# EasyEDA Pro project STM32平衡小车V1.1.eprj

# Schematic 平衡小车

## Sheets
1 STM32F103C8T6: Create Date: 2023-11-09; Page Name: STM32F103C8T6; Project Name: STM32平衡小车V1.1; Schematic Name: 平衡小车; Update Date: 2023-12-26; Company: 嘉立创EDA; Page Size: A4; Version: V1.0
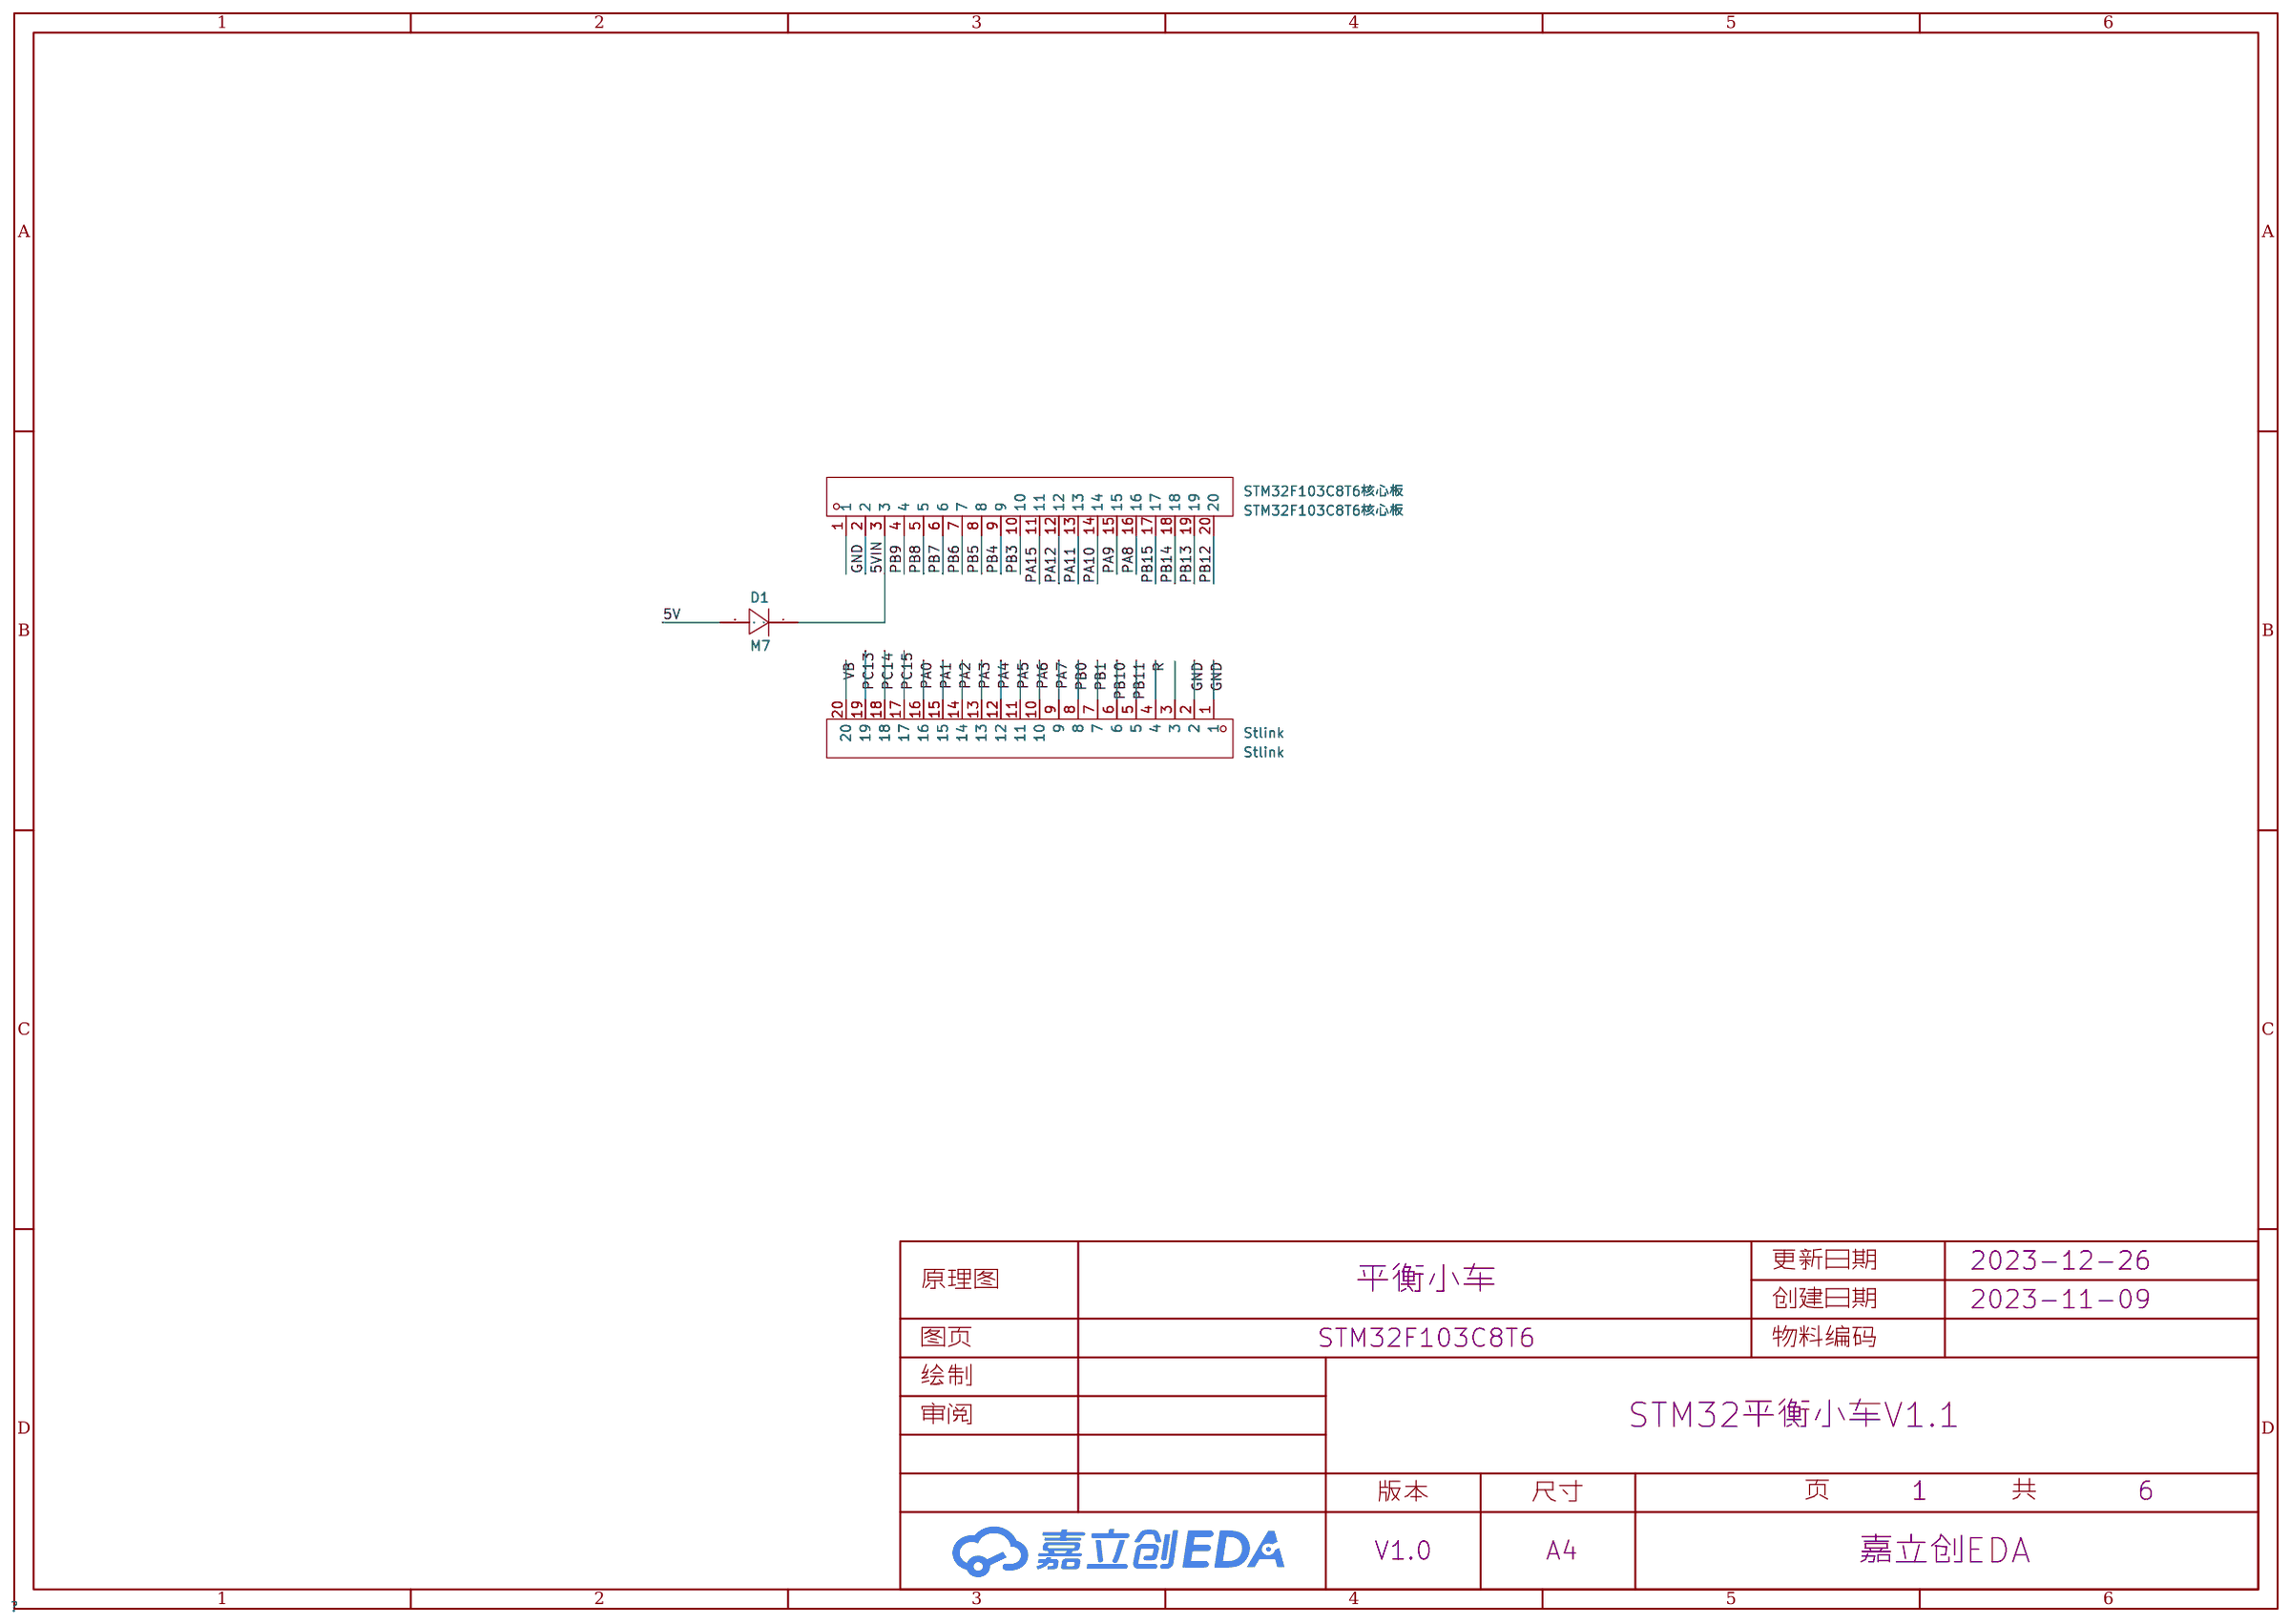
[diagram p0: STM32F103C8T6]
2 串口: Page Name: 串口; Project Name: STM32平衡小车V2.0; Update Date: 2023-12-01
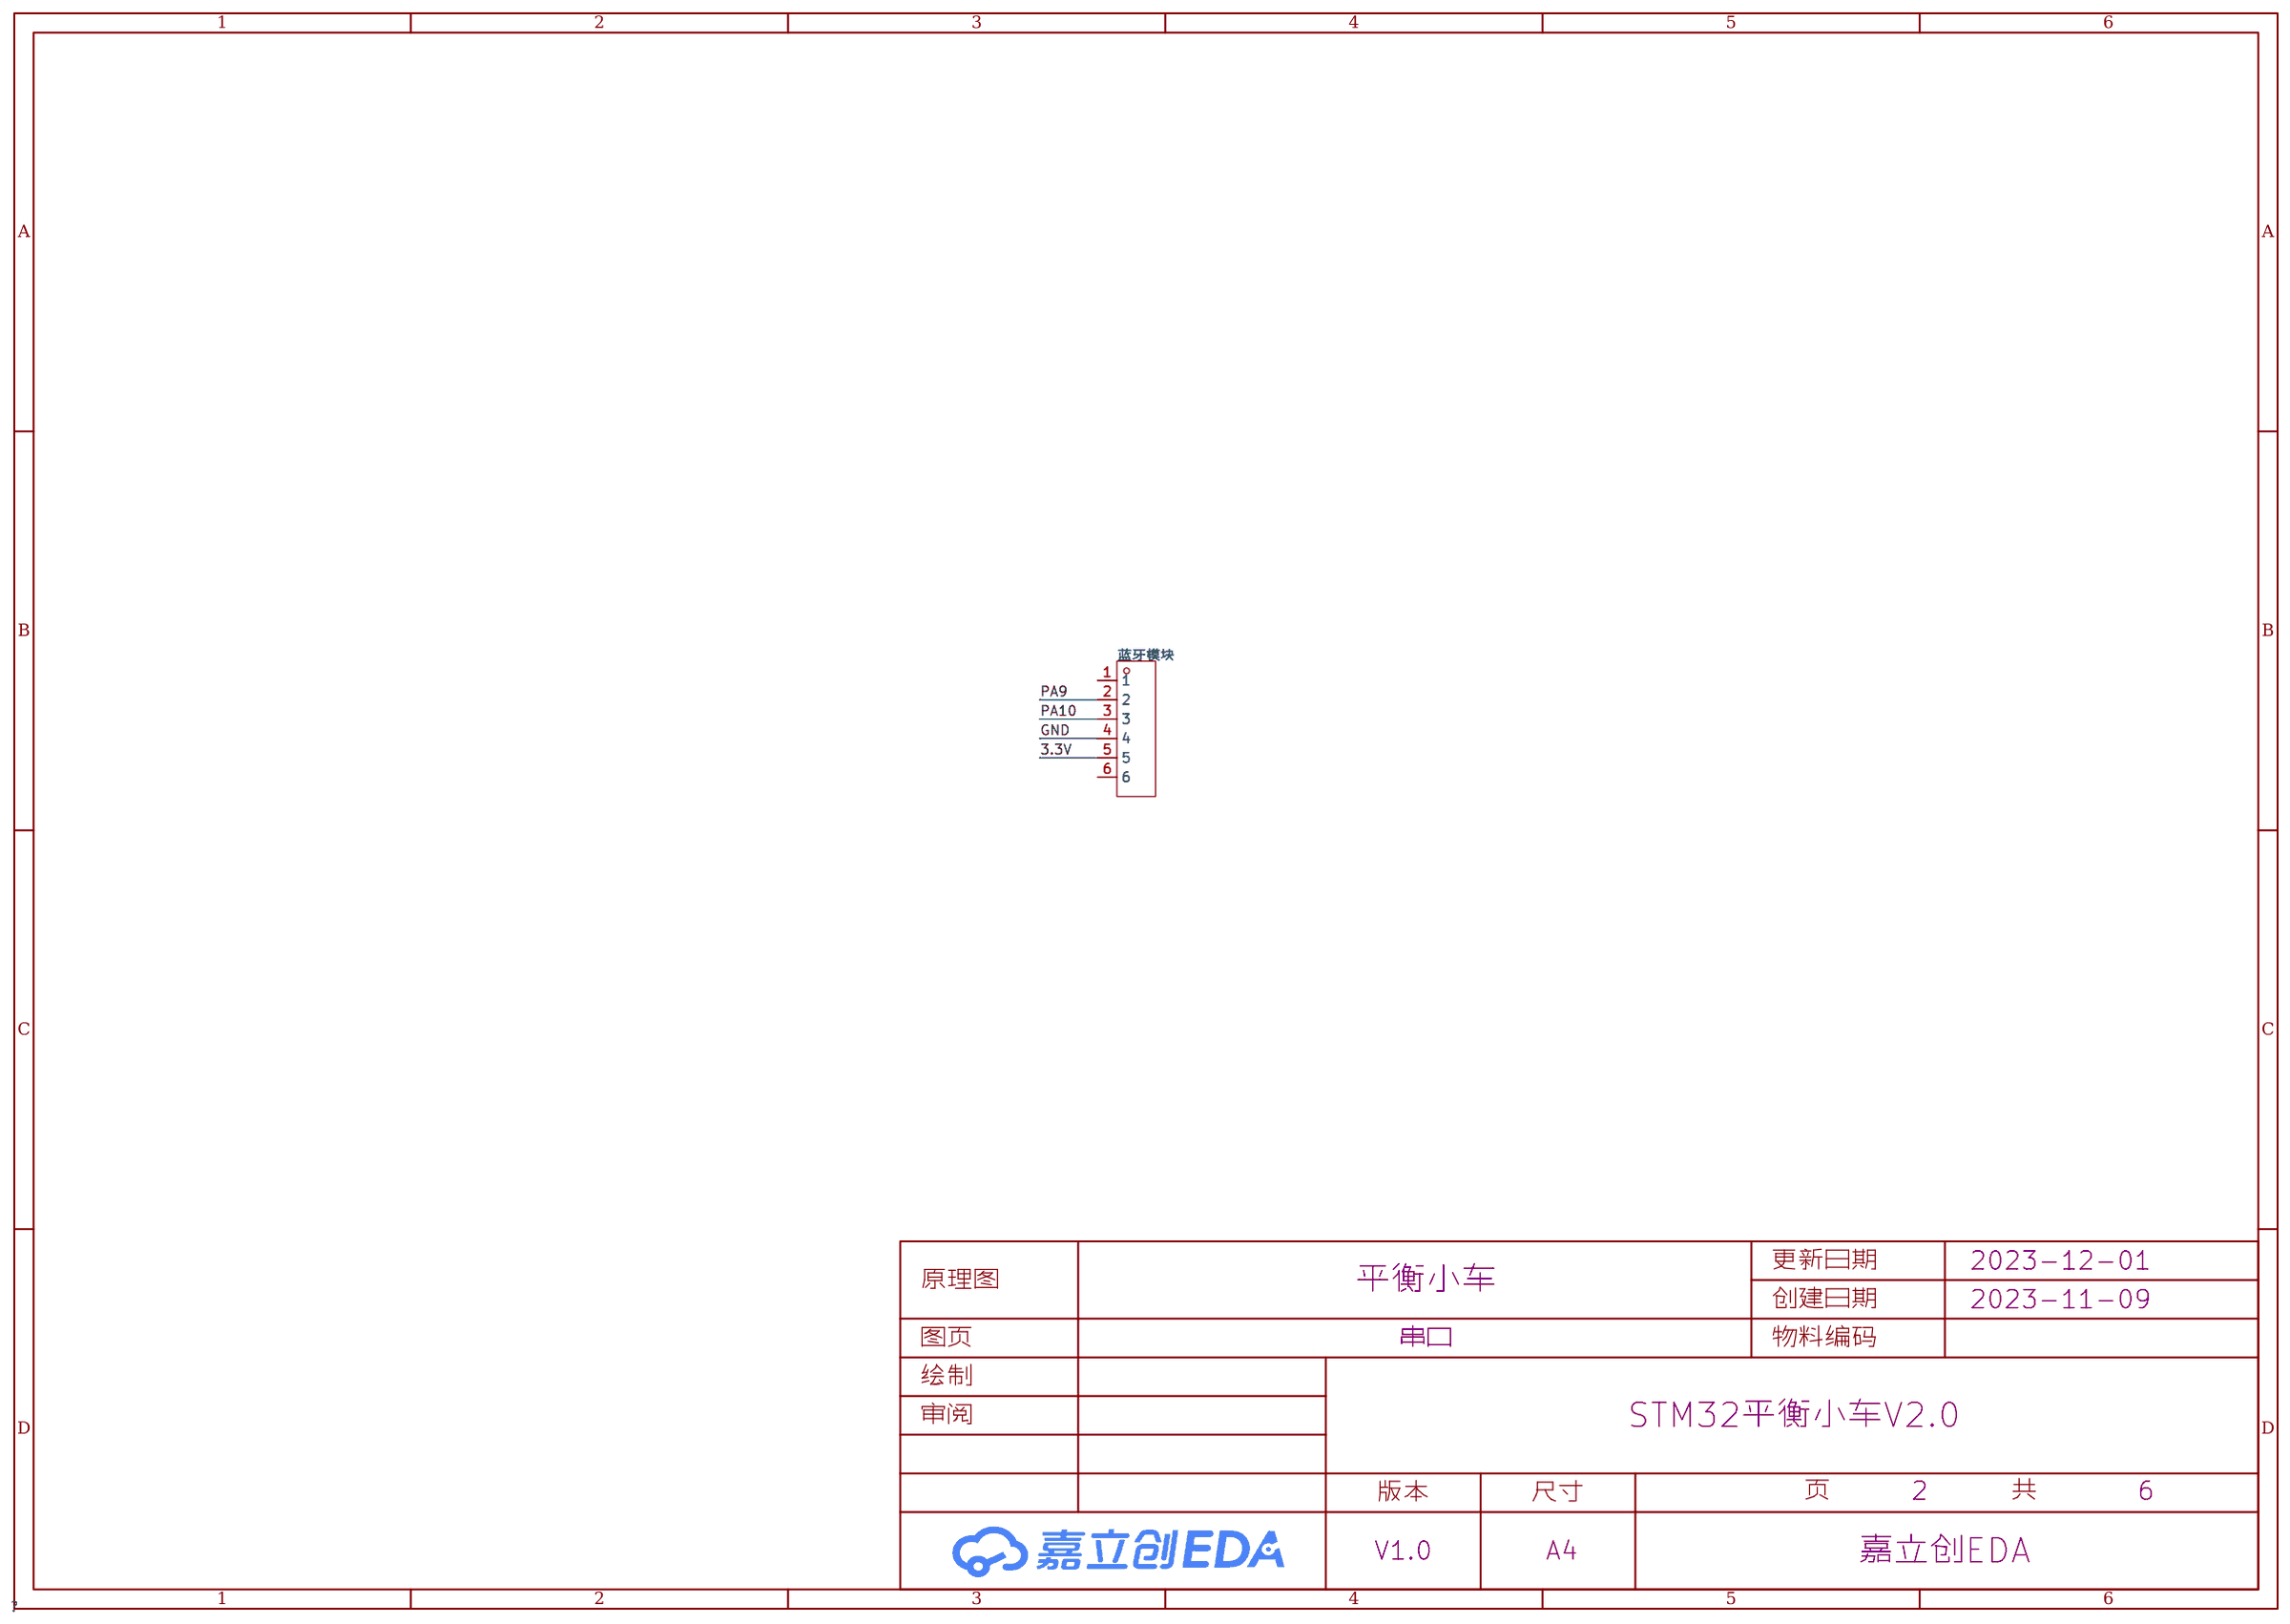
[diagram p1: 串口]
3 陀螺仪: Page Name: 陀螺仪; Project Name: STM32平衡小车V2.0; Update Date: 2023-12-01
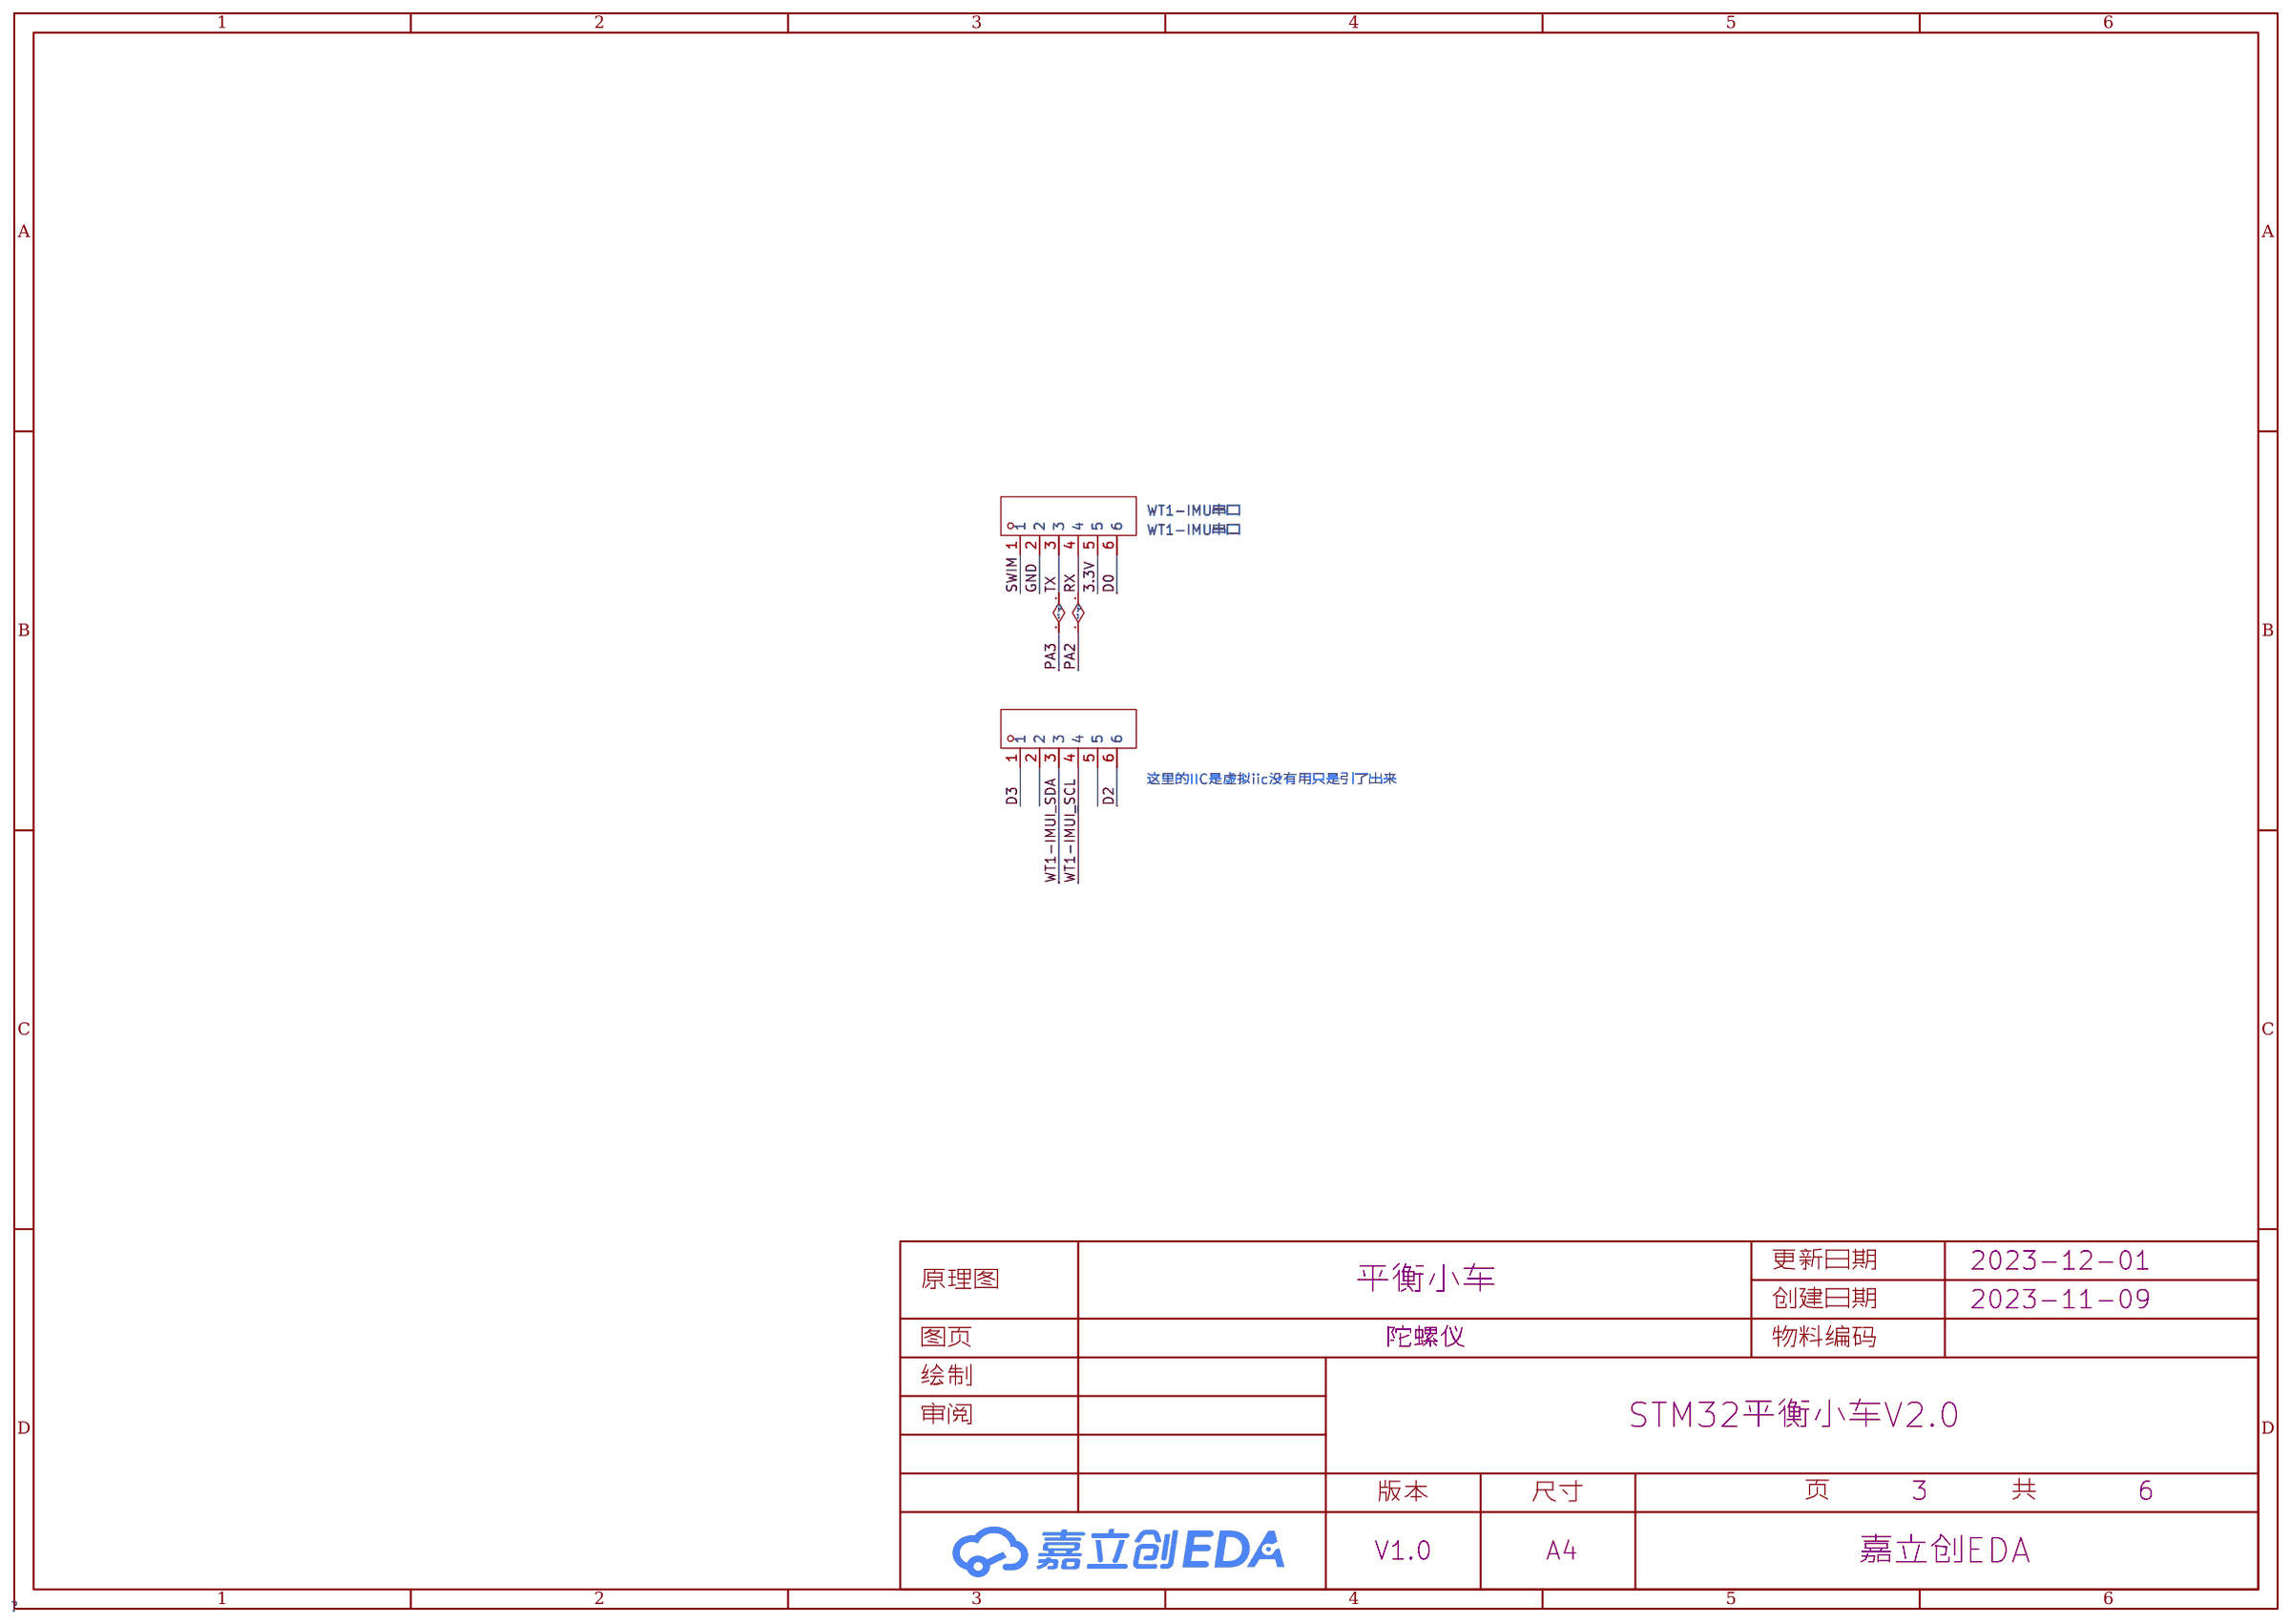
[diagram p2: 陀螺仪]
4 电源与降压模块: Page Name: 电源与降压模块; Project Name: STM32平衡小车V2.0; Update Date: 2023-12-01
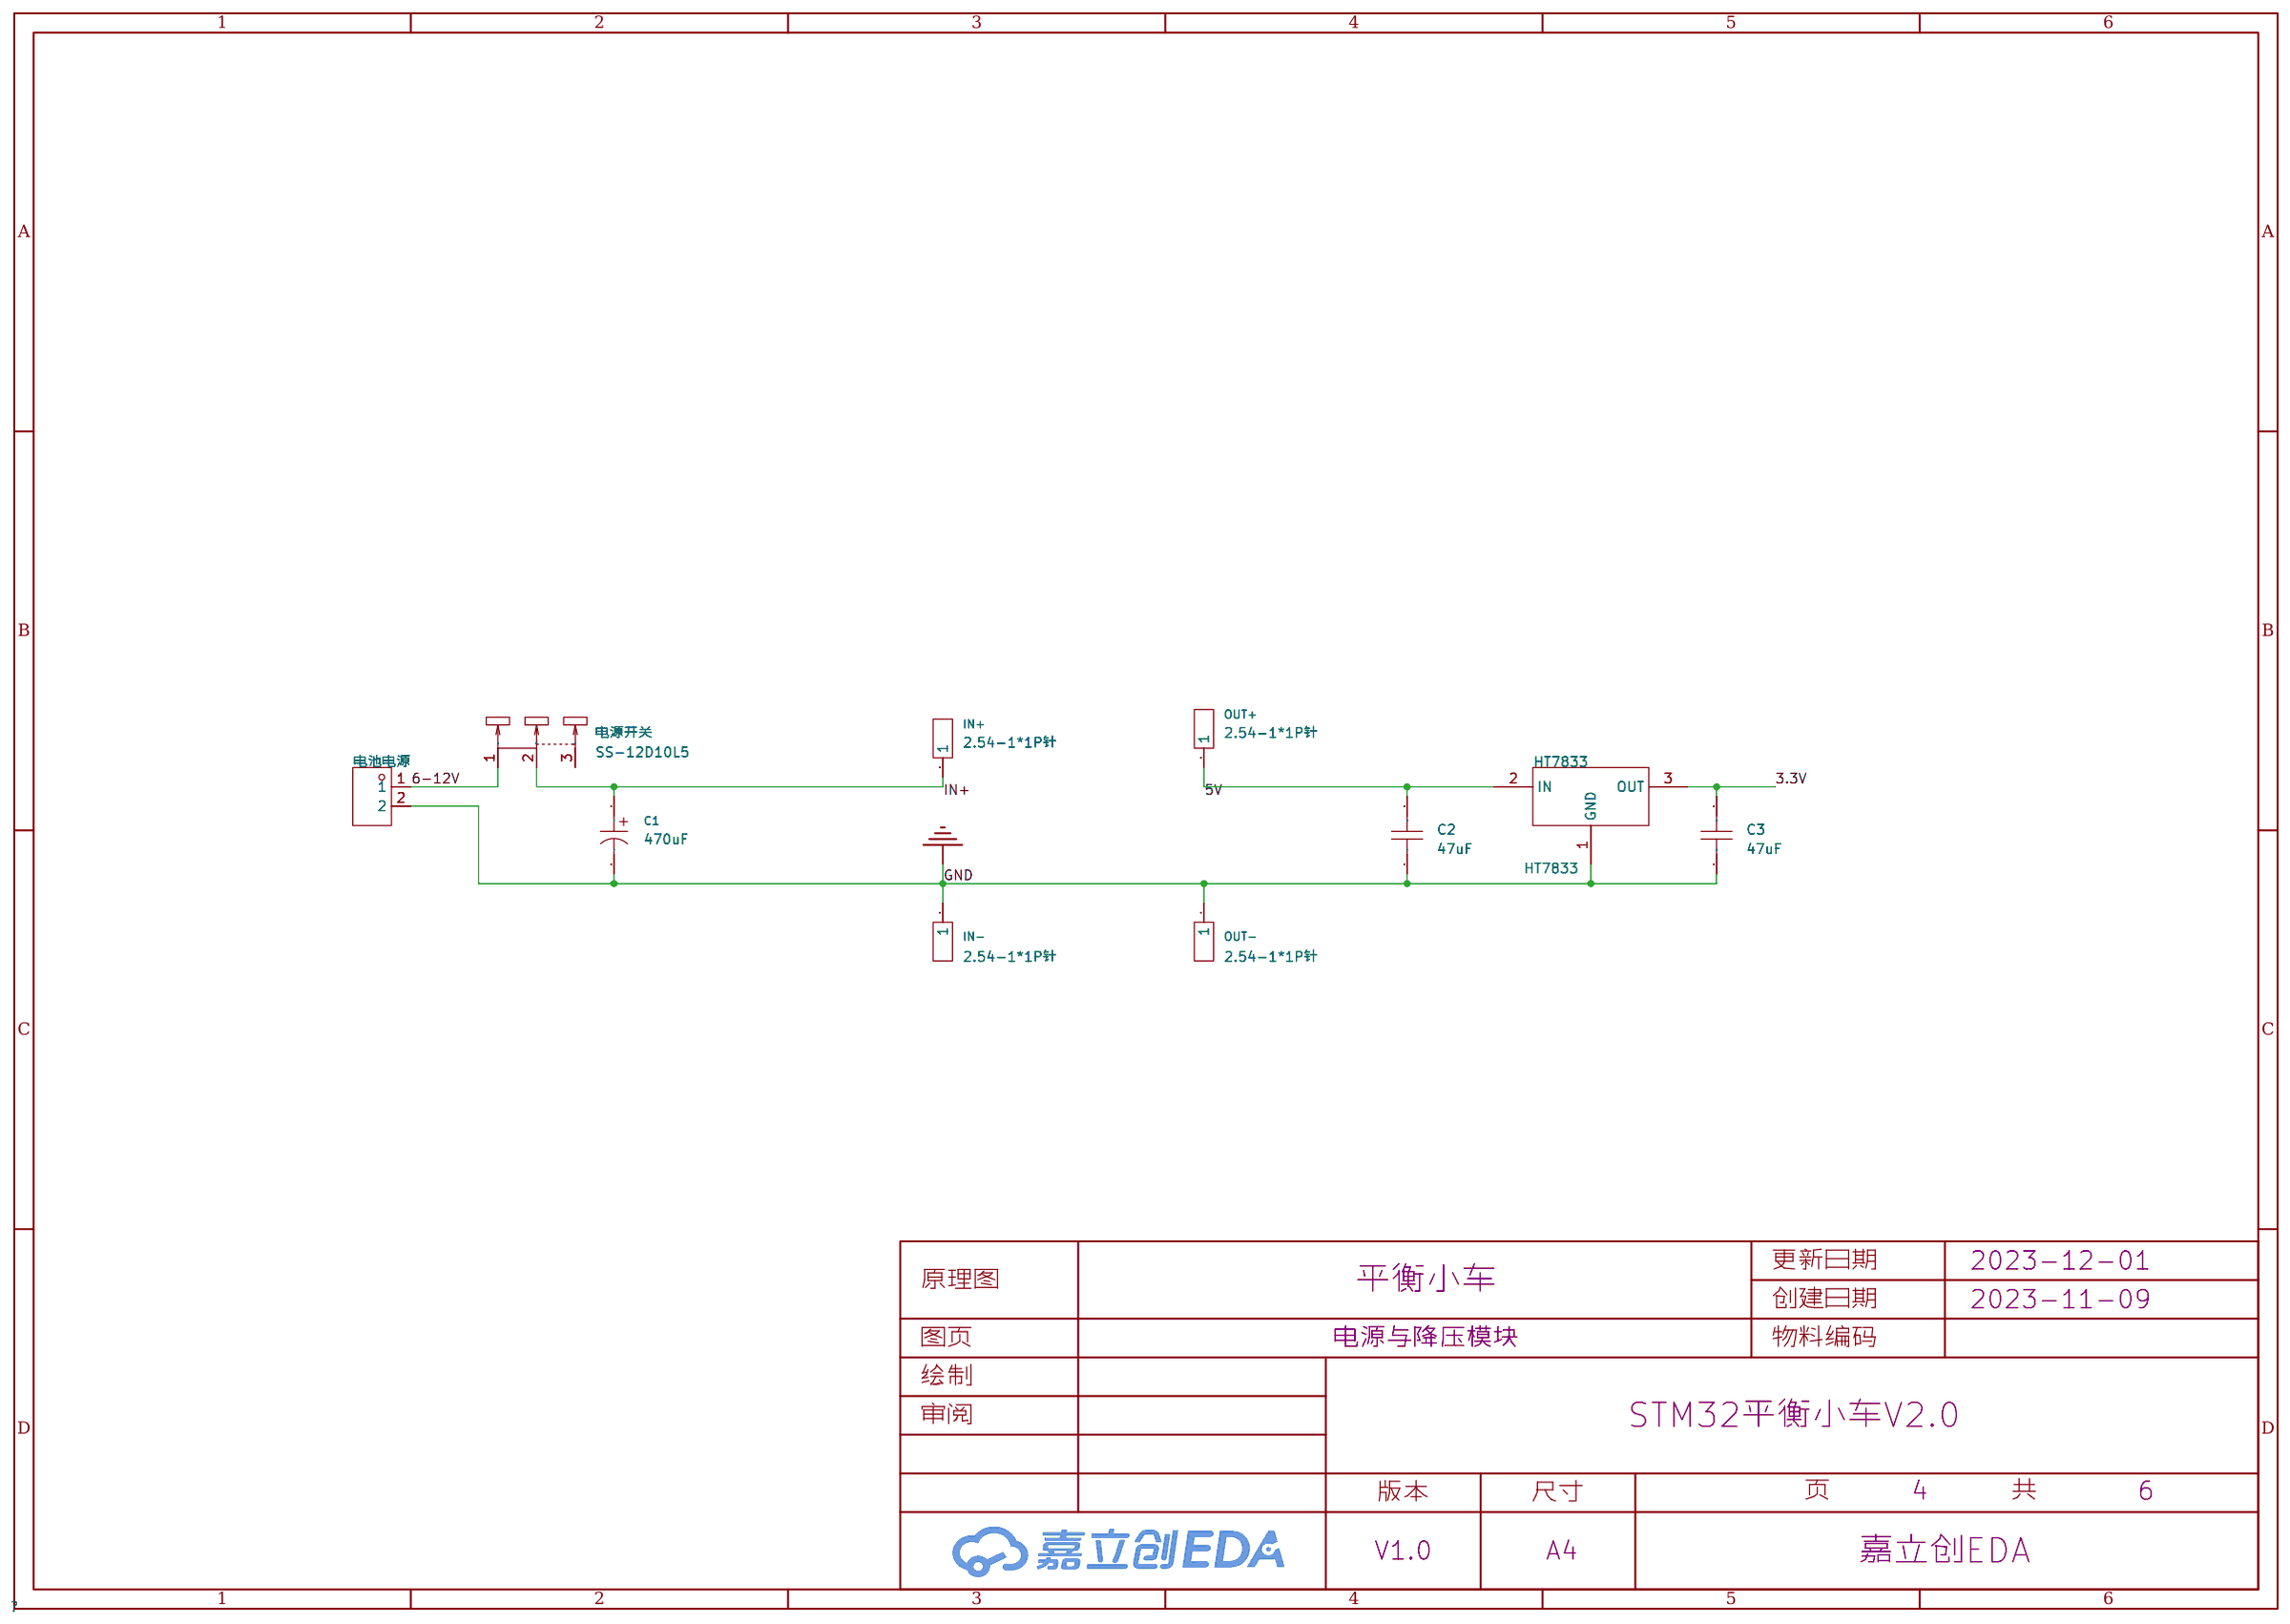
[diagram p3: 电源与降压模块]
5 电机驱动模块与电机接口: Page Name: 电机驱动模块与电机接口; Project Name: STM32平衡小车V2.0; Update Date: 2023-12-01
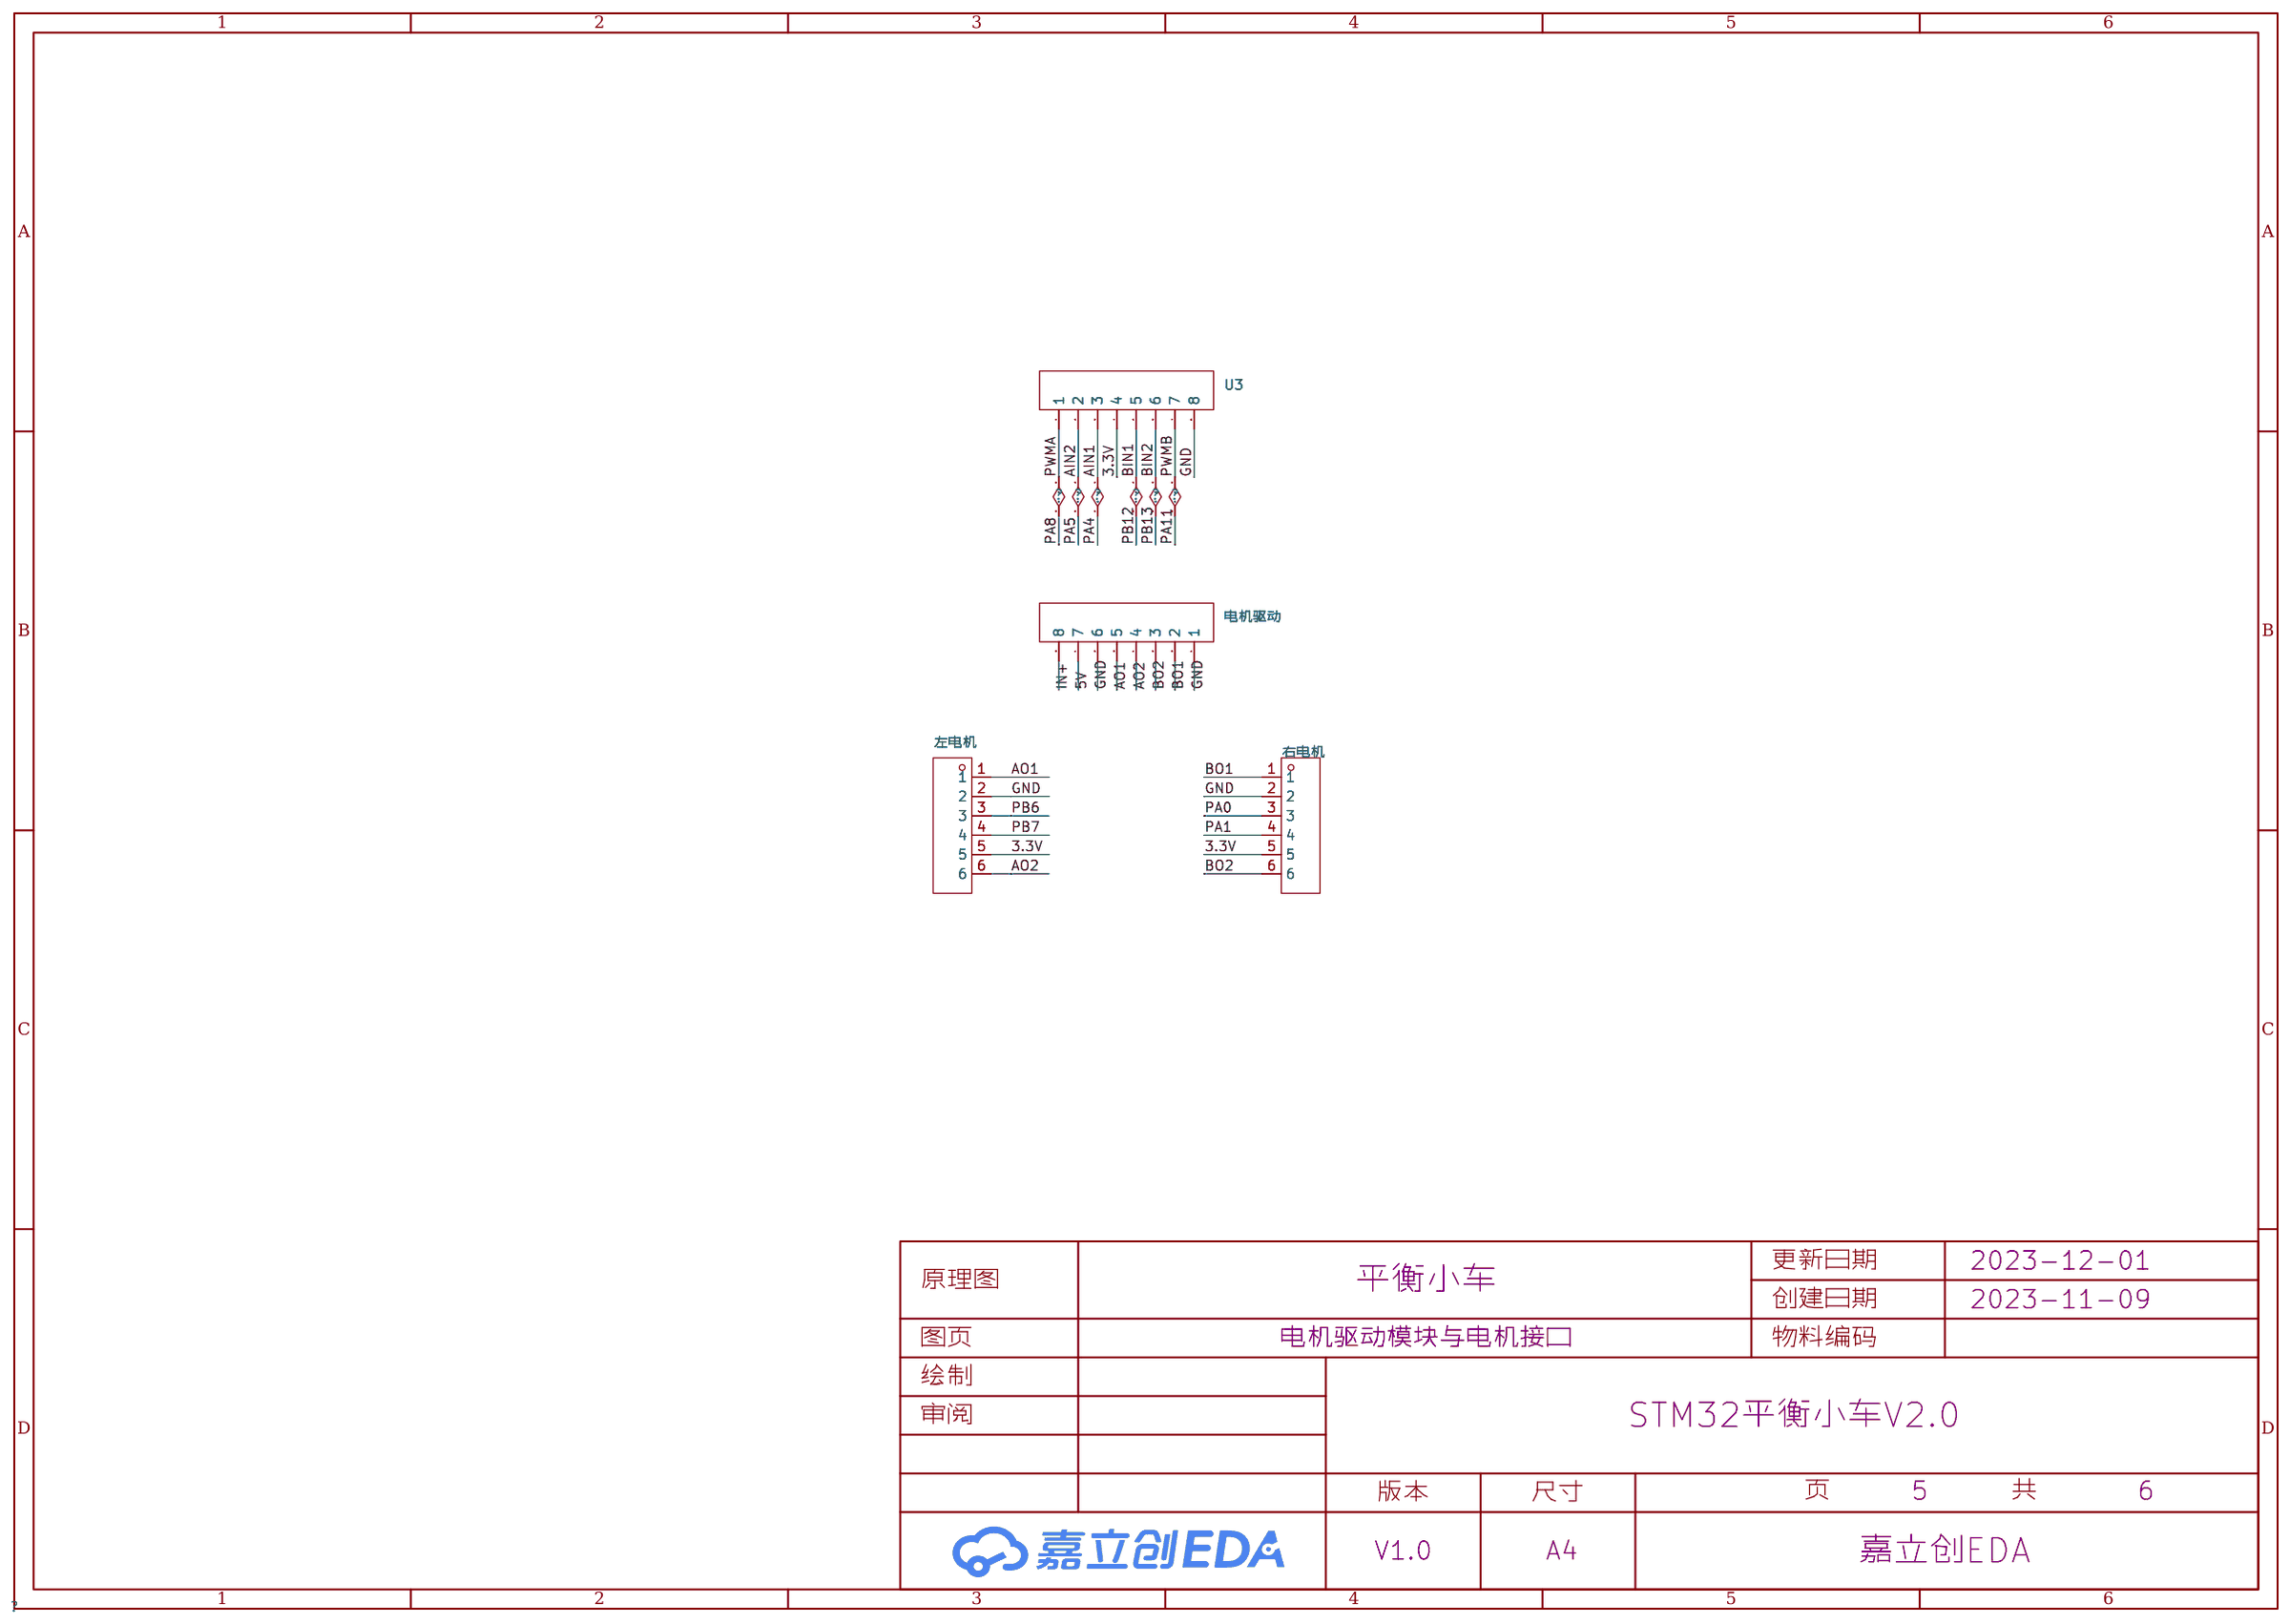
[diagram p4: 电机驱动模块与电机接口]
6 OLED: Page Name: OLED; Project Name: STM32平衡小车V2.0
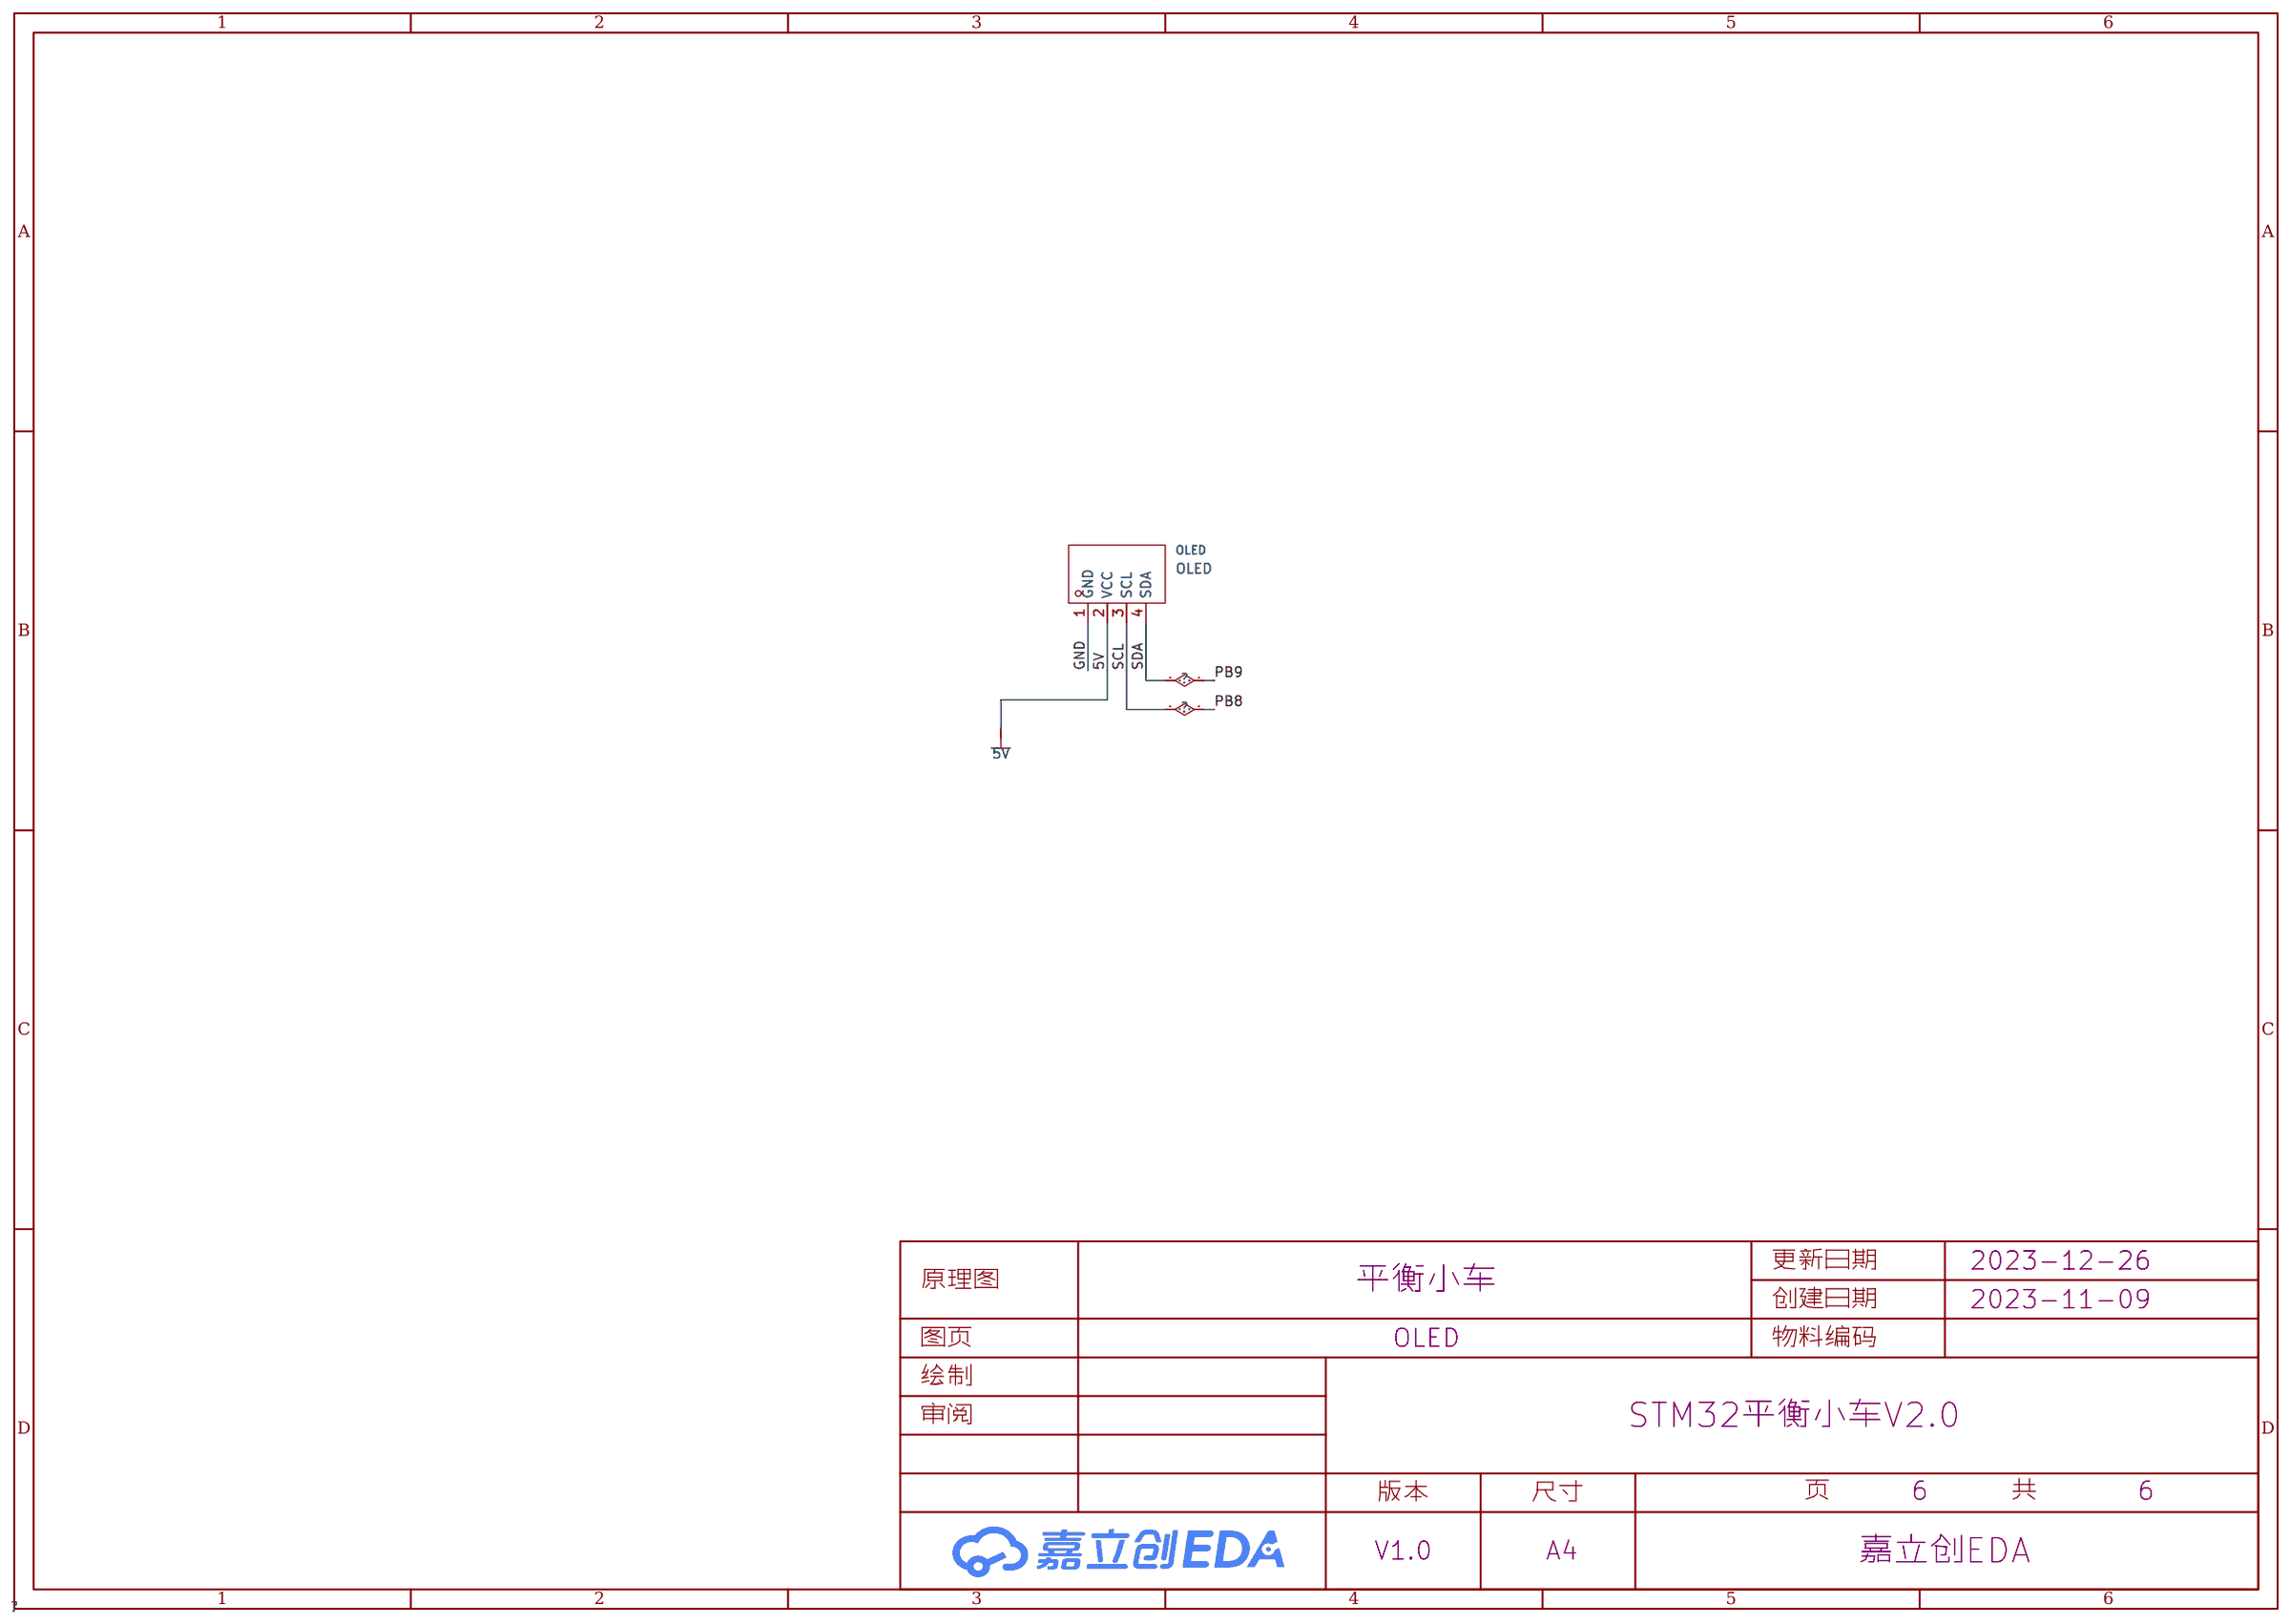
[diagram p5: OLED]

## Parts
sheet OLED
OLED  OLED  [OLED-TH_L27.8-W27.2-P2.54_C9900033791]
sheet STM32F103C8T6
D1  M7  [SMA_L4.3-W2.6-LS5.2-RD]
Stlink  Stlink  [HDR-TH_20P-P2.54-V-F]
STM32F103C8T6核心板  STM32F103C8T6核心板  [HDR-TH_20P-P2.54-V-F]
sheet 串口
蓝牙模块  2.54-1*6P母  [HDR-TH_6P-P2.54-V-F]
sheet 电机驱动模块与电机接口
U3  2.54-1*8P母环保  [HDR-TH_8P-P2.54-V-F-1]
右电机  HDGC2001WR-6P  [CONN-TH_6P-P2.00_HDGC_HDGC2001WR-6P]
左电机  HDGC2001WR-6P  [CONN-TH_6P-P2.00_HDGC_HDGC2001WR-6P]
电机驱动  2.54-1*8P母环保  [HDR-TH_8P-P2.54-V-F-1]
sheet 电源与降压模块
C1  470uF  [CAP-SMD_BD6.3-L6.6-W6.6-LS7.6-RD]
C2  47uF  [C0603]
C3  47uF  [C0603]
HT7833  HT7833  [SOT-89_L4.5-W2.5-P1.50-LS4.2-BR]
IN+  2.54-1*1P针  [HDR-TH_1P-P2.54-V-M]
IN-  2.54-1*1P针  [HDR-TH_1P-P2.54-V-M]
OUT+  2.54-1*1P针  [HDR-TH_1P-P2.54-V-M]
OUT-  2.54-1*1P针  [HDR-TH_1P-P2.54-V-M]
电池电源  ZX-XH2.54-2PZZ  [CONN-TH_2P-P2.50_HX25003-2A]
电源开关  SS-12D10L5  [SW-TH_SS-12D10L5]
sheet 陀螺仪
U1  2.54-1*6P母  [HDR-TH_6P-P2.54-V-F]
WT1-IMU串口  WT1-IMU串口  [HDR-TH_6P-P2.54-V-F]

## Library data of the parts
OLED = HS96L03W2C03: 尺寸(inch)：0.96寸 0.96&apos; 像素分辨率：128x64 128*64主控芯片：SSD1315 接口类型：I2C 外形:27.3*27.8；IIC/3SPI/4SPI串口通讯,工作温度范围-40℃—+70℃。4PIN黑底白光。; LCSC Part Name: 0.96寸OLED显示屏窄白光IIC; Supplier Part: C5248080; Manufacturer: HS(汉昇); JLCPCB Part Class: Extended Part; Datasheet: https://atta.szlcsc.com/upload/public/pdf/source/20230627/763D01F79A90007632F098068C7C8AD9.pdf; Supplier: LCSC
D1 = M7_C95872: 二极管配置:-;正向压降(Vf):1.1V@1A;直流反向耐压(Vr):1kV;平均整流电流(Io):1A;; LCSC Part Name: 电压:1kV 电流:1A; Supplier Part: C95872; Manufacturer: MDD; Supplier Footprint: SMA(DO-214AC); JLCPCB Part Class: 基础库; Datasheet: https://atta.szlcsc.com/upload/public/pdf/source/20230314/2A19294A7E86AE073FE0E8B47BC771B8.pdf; Supplier: LCSC; Forward Voltage (Vf@If): 1.1V@1A; Reverse Voltage (Vr): 1kV; Average Rectified Current (Io): 1A; Reverse Leakage Current: 5uA@1kV
Stlink STM32F103C8T6核心板 = 22850120ANG1SYA01: 排数:单排;总孔位数:20P;间距:2.54mm;插孔结构:1x20P;行距:-;安装类型:直插;塑高:-;触头材质:黄铜;触头镀层:-;; LCSC Part Name: 间距:2.54mm 1x20P 直插; Supplier Part: C429947; Manufacturer: JILN(锦凌); Supplier Footprint: 插件,P=2.54mm; JLCPCB Part Class: 扩展库; Datasheet: https://atta.szlcsc.com/upload/public/pdf/source/20190920/C429966_F6288D72CB1EF194DAF75E8AC5D57877.pdf; Supplier: LCSC; Number of Rows: 单排; Number of Holes: 20P; Pitch: 2.54mm; Holes Structure: 1x20P; Mounting Type: 直插; Contact Material: 黄铜
U1 WT1-IMU串口 蓝牙模块 = 2.54-1*6P母: 排数:单排;总孔位数:6P;间距:2.54mm;插孔结构:1x6P;行距:-;安装类型:直插;塑高:-;触头材质:-;触头镀层:-;; LCSC Part Name: 间距:2.54mm 1x6P 直插; Supplier Part: C40877; Manufacturer: BOOMELE(博穆精密); Supplier Footprint: 插件,P=2.54mm; JLCPCB Part Class: 扩展库; Datasheet: https://atta.szlcsc.com/upload/public/pdf/source/20210301/C2718488_F4427B881E42CAA8DDB0B1C12B3A522C.pdf; Supplier: LCSC; Number of Rows: 单排; Number of Holes: 6P; Pitch: 2.54mm; Holes Structure: 1x6P; Mounting Type: 直插
U3 电机驱动 = 2.54-1*8P母环保: 排数:单排;总孔位数:8P;间距:2.54mm;插孔结构:1x8P;行距:-;安装类型:直插;塑高:-;触头材质:-;触头镀层:-;; LCSC Part Name: 间距:2.54mm 1x8P 直插; Supplier Part: C27438; Manufacturer: BOOMELE(博穆精密); Supplier Footprint: 插件,P=2.54mm; JLCPCB Part Class: Extended Part; Datasheet: https://atta.szlcsc.com/upload/public/pdf/source/20210301/C2718488_F4427B881E42CAA8DDB0B1C12B3A522C.pdf; Supplier: LCSC; Number of Rows: 单排; Number of Holes: 8P; Pitch: 2.54mm; Holes Structure: 1x8P; Mounting Type: 直插
右电机 左电机 = HDGC2001WR-6P: LCSC Part Name: PH2.0弯针 6P; Supplier Part: C5175243; Manufacturer: HDGC(华德共创); Supplier Footprint: 弯插,P=2mm; JLCPCB Part Class: 扩展库; Datasheet: https://atta.szlcsc.com/upload/public/pdf/source/20220916/36534CA64A2134C65DEF28B604EC5CCB.pdf; Supplier: LCSC
C1 = RVT1C471M0607: 容值:470uF;精度:±20%;额定电压:16V;电容体直径:6.3mm;电容体长度:7.7mm;工作寿命:2000hrs@105℃;工作温度:-55℃~+105℃;; LCSC Part Name: 470uF ±20% 16V; Supplier Part: C2977552; Manufacturer: ROQANG(容强); Supplier Footprint: SMD,6.3x7.7mm; JLCPCB Part Class: 扩展库; Supplier: LCSC; Tolerance: ±20%; Rated Voltage: 16V; φD: 6.3mm; L: 7.7mm; Lifetime @ Temp: 2000hrs@105℃; Operating Temperature: -55℃~+105℃
C2 C3 = CC0603KRX7R9BB104: 容值:100nF;精度:±10%;额定电压:50V;材质(温度系数):X7R;; LCSC Part Name: 100nF ±10% 50V; Supplier Part: C14663; Manufacturer: YAGEO(国巨); Supplier Footprint: 0603; JLCPCB Part Class: 基础库; Datasheet: https://atta.szlcsc.com/upload/public/pdf/source/20180910/C282072_33301C7F631E79921B82A8DAC6BCC5B3.pdf; Supplier: LCSC; Tolerance: ±10%; Voltage Rated: 50V; Temperature Coefficient: X7R
HT7833 = HT7833_C50936: 输出类型:固定;输出极性:正;最大输入电压:8V;输出电压:3.3V;输出电流:500mA;电源纹波抑制比(PSRR):-;; Supplier Part: C50936; Manufacturer: HOLTEK(合泰/盛群); Supplier Footprint: SOT-89-3; JLCPCB Part Class: 扩展库; Datasheet: https://atta.szlcsc.com/upload/public/pdf/source/20150618/1457707321825.pdf; Supplier: LCSC; Output Type: 固定; Output Polarity: 正; Number of Outputs: 1; Maximum Input Voltage: 8V; Output Voltage: 3.3V; Dropout Voltage: 500mV@(500mA); Output Current: 500mA
IN+ IN- OUT+ OUT- = 2.54-1*1P针: 排数:单排;总PIN位数:1P;间距:-;插针结构:-;行距:-;安装类型:直插;圆针/方针:-;额定电流:-;额定电压:-;配合针长度:-;塑高:-;触头材质:-;触头镀层:-;颜色:黑色;; LCSC Part Name: 直插; Supplier Part: C81276; Manufacturer: BOOMELE(博穆精密); Supplier Footprint: 插件,P=2.54mm; JLCPCB Part Class: 扩展库; Datasheet: https://atta.szlcsc.com/upload/public/pdf/source/20221018/3E9408392E35E6F57A28985E5F7BF5C9.pdf; Supplier: LCSC; Number of Rows: 单排; Number of Pins: 1P; Mounting Type: 直插; Color: 黑色
电池电源 = ZX-XH2.54-2PZZ: 插针结构:1x2P;间距:2.54mm;公母:公;安装方式:直插;行距:-;排数:1;每排PIN数:2;参考系列:XH;额定电流:3A;触头材质:黄铜;触头镀层:锡;工作温度范围:-25℃~+85℃;焊接温度(最大值):260℃;; LCSC Part Name: 1x2P 间距:2.54mm 直插 系列:XH; Supplier Part: C7429632; Manufacturer: Megastar(兆星); Supplier Footprint: 插件,P=2.54mm; JLCPCB Part Class: 扩展库; Datasheet: https://atta.szlcsc.com/upload/public/pdf/source/20230619/19BA6947230AA44A04D3EDD65E618FD0.pdf; Supplier: LCSC; Pins Structure: 1x2P; Pitch: 2.54mm; Gender: 公; Mounting Style: 直插; Number of Rows: 1; Number of PINs Per Row: 2; Reference Series: XH; Current Rating (Max): 3A; Contact Material: 黄铜; Contact Plating: 锡; Operating Temperature Range: -25℃~+85℃; Welding Temperature (Max): 260℃
电源开关 = SS-12D10L5: 额定电流(DC):3A;额定电压(DC):125V;额定电流(AC):3A;额定电压(AC):125V;电路结构:单刀双掷;安装方式:直插;机械寿命:1万次;开关颜色:黑色;; LCSC Part Name: 柄长5mm 直插双档 滑动开关 大电流; Supplier Part: C319012; Manufacturer: XKB Connectivity(中国星坤); Supplier Footprint: 插件; JLCPCB Part Class: 扩展库; Datasheet: https://atta.szlcsc.com/upload/public/pdf/source/20211009/D6412F37AABE6F9459A6EE7FA4DAEADB.pdf; Supplier: LCSC; Current Rating (DC): 3A; Voltage Rating (DC): 125V; Current Rating (AC): 3A; Voltage Rating (AC): 125V; Circuit: 单刀双掷; Mounting Style: 直插; Mechanical Life: 1万次; Actuator Color: 黑色; Actuator Style: 矩形柱状; Pin Style: PC引脚; Operating Temperature: -40℃~+85℃; Switch Length: 13mm; Switch Width: 6.8mm; Switch Height: 6.4mm

## Nets
3.3V: C3.2 HT7833.3(OUT) U3.4 WT1-IMU串口.5 右电机.5 左电机.5 蓝牙模块.5
5V: C2.2 D1.2(A) HT7833.2(IN) OLED.2(VCC) OUT+.1 电机驱动.7
5VIN: D1.1(K) STM32F103C8T6核心板.3
GND: C1.2 C2.1 C3.1 HT7833.1(GND) IN-.1 OLED.1(GND) OUT-.1 Stlink.1 Stlink.2 STM32F103C8T6核心板.2 U3.8 WT1-IMU串口.2 右电机.2 左电机.2 电机驱动.1 电机驱动.6 电池电源.2 蓝牙模块.4
6-12V: 电池电源.1 电源开关.1
AIN1: Stlink.12 U3.3
AIN2: Stlink.11 U3.2
AO1: 左电机.1 电机驱动.5
AO2: 左电机.6 电机驱动.4
BIN1: STM32F103C8T6核心板.20 U3.5
BIN2: STM32F103C8T6核心板.19 U3.6
BO1: 右电机.1 电机驱动.2
BO2: 右电机.6 电机驱动.3
D0: WT1-IMU串口.6
D2: U1.6
D3: U1.1
IN+: C1.1 IN+.1 电机驱动.8 电源开关.2
PA0: Stlink.16 右电机.3
PA1: Stlink.15 右电机.4
PA2: Stlink.14 WT1-IMU串口.4
PA3: Stlink.13 WT1-IMU串口.3
PA6: Stlink.10
PA7: Stlink.9
PA8: STM32F103C8T6核心板.16 U3.1
PA9: STM32F103C8T6核心板.15 蓝牙模块.2
PA10: STM32F103C8T6核心板.14 蓝牙模块.3
PA11: STM32F103C8T6核心板.13 U3.7
PA12: STM32F103C8T6核心板.12
PA15: STM32F103C8T6核心板.11
PB0: Stlink.8
PB1: Stlink.7
PB3: STM32F103C8T6核心板.10
PB4: STM32F103C8T6核心板.9
PB5: STM32F103C8T6核心板.8
PB6: STM32F103C8T6核心板.7 左电机.3
PB7: STM32F103C8T6核心板.6 左电机.4
PB8: OLED.3(SCL) STM32F103C8T6核心板.5
PB9: OLED.4(SDA) STM32F103C8T6核心板.4
PB10: Stlink.6
PB11: Stlink.5
PB14: STM32F103C8T6核心板.18
PB15: STM32F103C8T6核心板.17
PC13: Stlink.19
PC14: Stlink.18
PC15: Stlink.17
R: Stlink.4
SWIM: WT1-IMU串口.1
VB: Stlink.20
WT1-IMUI_SCL: U1.4
WT1-IMUI_SDA: U1.3

Not connected (* = marked no-connect by the designer): Stlink 3; STM32F103C8T6核心板 1; U1 2 5; 电源开关 3; 蓝牙模块 1 6

## Notes on the sheets
sheet 3
- 这里的IIC是虚拟iic没有用只是引了出来

# Board PCB1
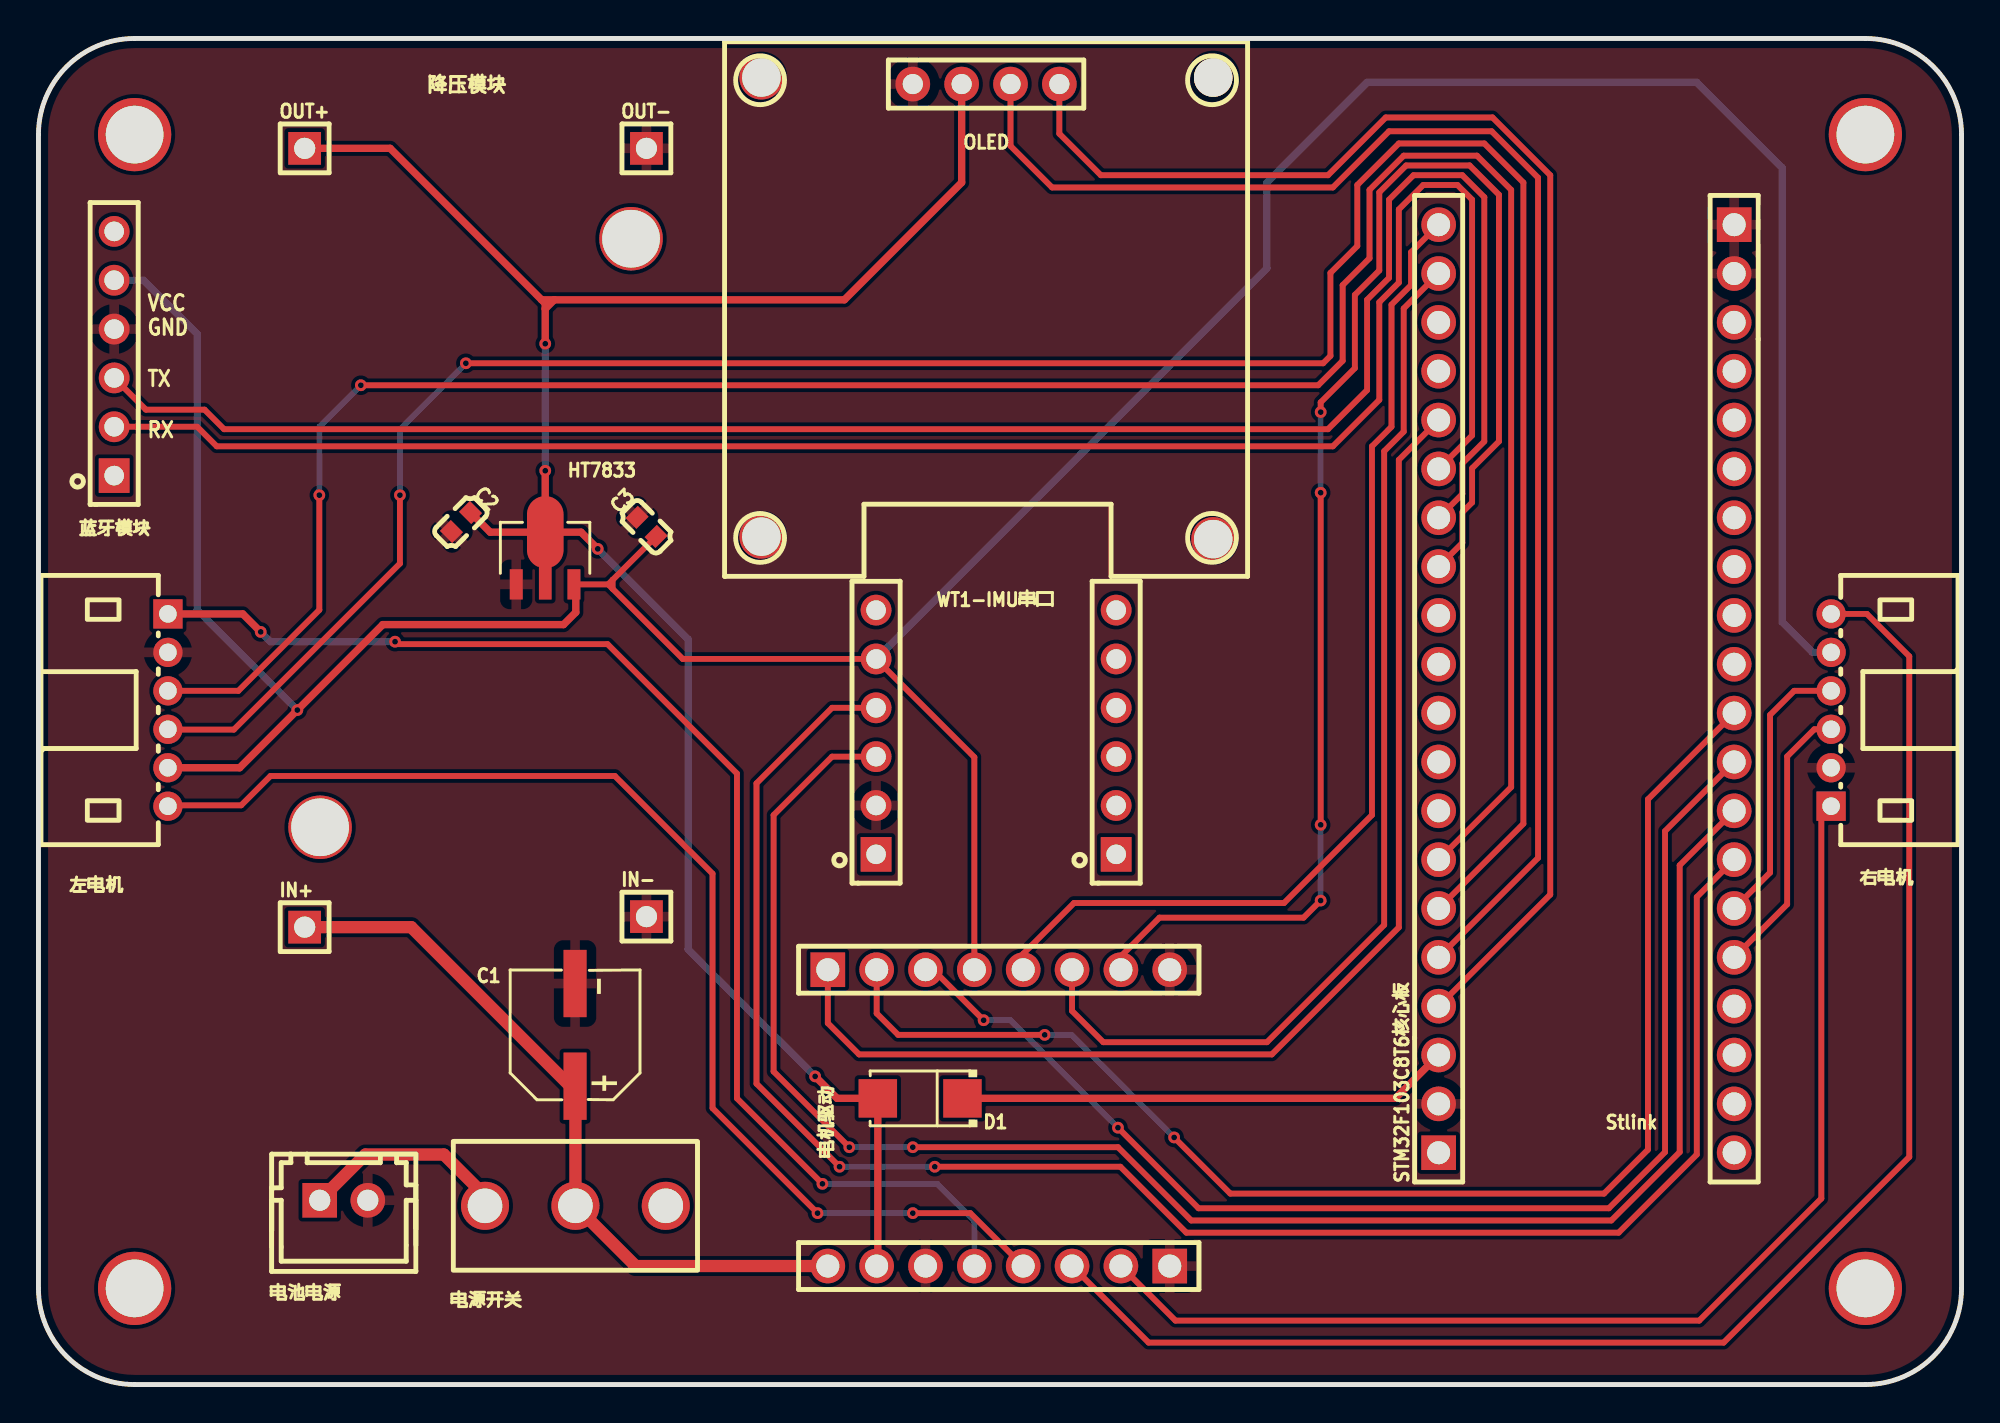
[diagram p6: board, top side]
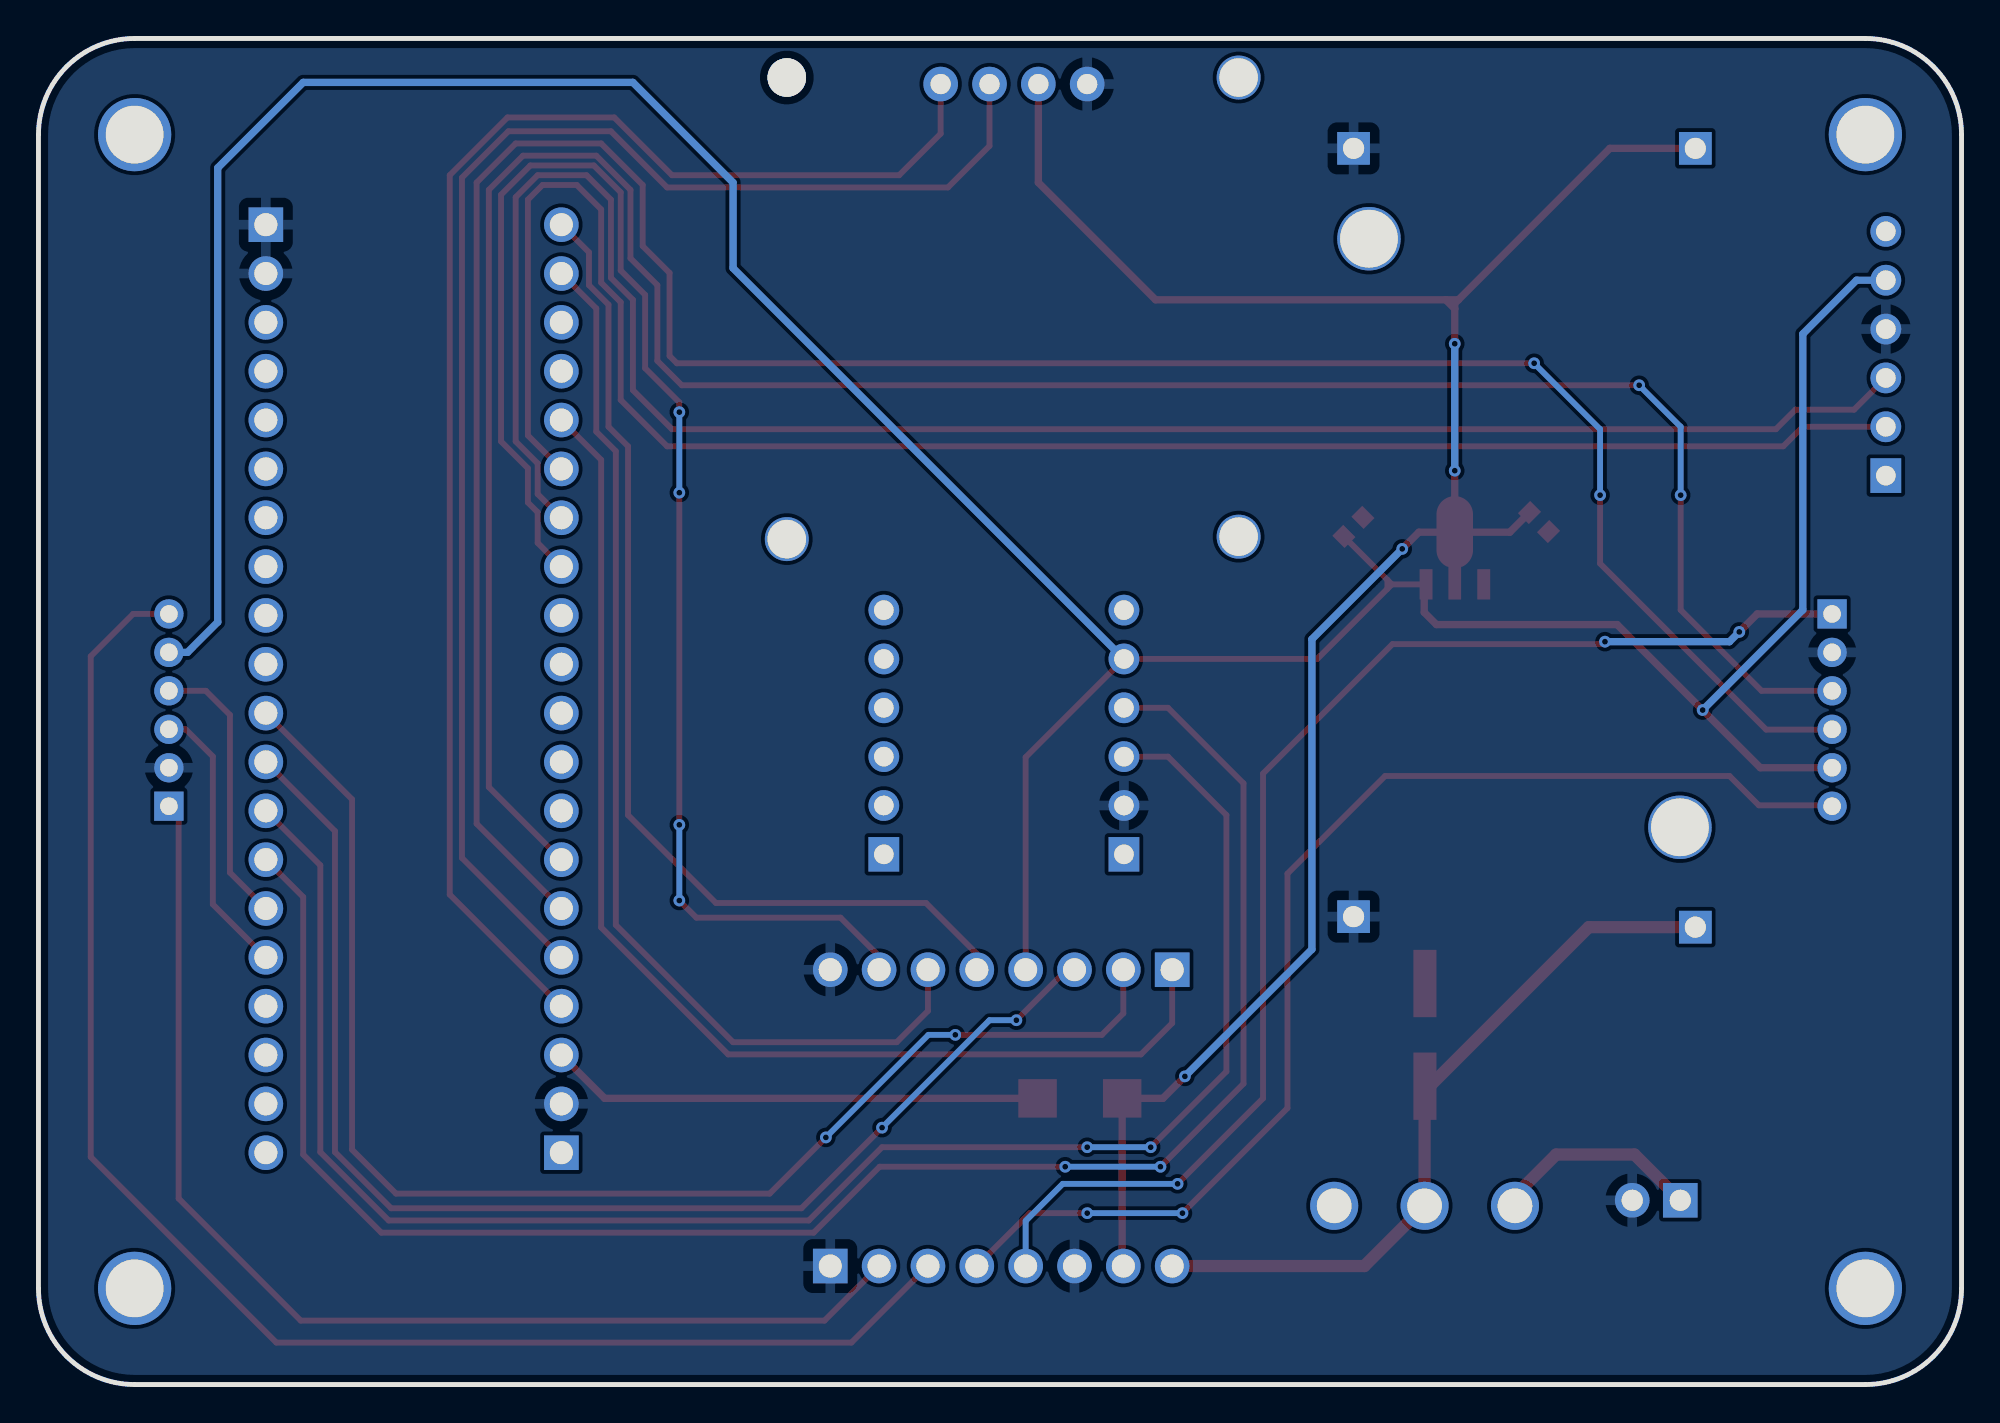
[diagram p7: board, bottom side, seen from below]

Outline 100 x 70 mm; copper layers: Top Layer, Bottom Layer. Coordinates in mm from the lower left corner of the outline.
Outline path: 0,65 0,5 arc(1.46,1.46) 5,0 95,0 arc(98.54,1.46) 100,5 100,65 arc(98.54,68.54) 95,70 5,70 arc(1.46,68.54) 0,65
Stack: Top Layer 0.035mm / Dielectric1 1.51mm FR4 er 4.5 / Bottom Layer 0.035mm

## Design rules (mm)
template: JLCPCB Capability(Two Layers Board)
spacing copperThickness1oz (default): track to track 0.102, other pairs 0.152 to 0.3
spacing copperThickness2oz: track to track 0.203, other pairs 0.152 to 0.3
track width copperThickness1oz (default): min 0.127, default 0.254, max 2.54
track width copperThickness2oz: min 0.203, default 0.254, max 2.54
differential pair differentialPair (default): width min 0.127, default 0.254, max 2.54; gap min 0.152, default 0.152
via viaSize (default): diameter min 0.5, default 0.61, max 10; hole min 0.3, default 0.305, max 6.3

## Placement (name value [footprint] x y rotation side)
C1  470uF  [CAP-SMD_BD6.3-L6.6-W6.6-LS7.6-RD]  27.9 18.18 90 top
C2  47uF  [C0603]  21.97 44.85 45 top
C3  47uF  [C0603]  31.62 44.6 315 top
D1  M7  [SMA_L4.3-W2.6-LS5.2-RD]  45.85 14.88 180 top
HT7833  HT7833  [SOT-89_L4.5-W2.5-P1.50-LS4.2-BR]  26.34 42.97 270 top
IN+  2.54-1*1P针  [HDR-TH_1P-P2.54-V-M]  13.84 23.79 0 top
IN-  2.54-1*1P针  [HDR-TH_1P-P2.54-V-M]  31.61 24.33 0 top
NOREF  -  [Pad_e71]  14.64 28.98 0 top
NOREF#2  -  [Pad_e1738]  5 5 0 top
NOREF#3  -  [Pad_e103]  30.81 59.59 0 top
NOREF#4  -  [Pad_e1712]  95 5 0 top
NOREF#5  -  [Pad_e1713]  5 65 0 top
NOREF#6  -  [Pad_e1710]  95 65 0 top
NOREF#7  -  [Pad_e48]  37.59 44.09 0 top
NOREF#8  -  [Pad_e47]  61.09 43.96 0 top
NOREF#9  -  [Pad_e45]  61.09 67.97 0 top
NOREF#10  -  [Pad_e40]  37.59 67.97 0 top
OLED  OLED  [OLED-TH_L27.8-W27.2-P2.54_C9900033791]  49.28 67.63 0 top
OUT+  2.54-1*1P针  [hdr-th_1p-p2.54-v-m]  13.84 64.28 0 top
OUT-  2.54-1*1P针  [hdr-th_1p-p2.54-v-m]  31.61 64.28 0 top
Stlink  Stlink  [HDR-TH_20P-P2.54-V-F]  88.18 36.19 270 top
STM32F103C8T6核心板  STM32F103C8T6核心板  [HDR-TH_20P-P2.54-V-F]  72.81 36.19 90 top
U1  2.54-1*6P母  [HDR-TH_6P-P2.54-V-F]  56.04 33.92 90 top
U3  2.54-1*8P母环保  [HDR-TH_8P-P2.54-V-F-1]  49.94 21.57 0 top
WT1-IMU串口  WT1-IMU串口  [HDR-TH_6P-P2.54-V-F]  43.56 33.92 90 top
右电机  HDGC2001WR-6P  [CONN-TH_6P-P2.00_HDGC_HDGC2001WR-6P]  93.22 35.07 90 top
左电机  HDGC2001WR-6P  [CONN-TH_6P-P2.00_HDGC_HDGC2001WR-6P]  6.73 35.07 270 top
电机驱动  2.54-1*8P母环保  [HDR-TH_8P-P2.54-V-F-1]  49.94 6.16 180 top
电池电源  ZX-XH2.54-2PZZ  [CONN-TH_2P-P2.50_HX25003-2A]  15.88 9.58 0 top
电源开关  SS-12D10L5  [SW-TH_SS-12D10L5]  27.92 9.29 0 top
蓝牙模块  2.54-1*6P母  [HDR-TH_6P-P2.54-V-F]  3.94 53.62 90 top

## Footprints (pads in the part's own frame, mm; a bottom-side part is the same pattern mirrored in y, then rotated)
C0603
  rect 0.8x0.9 smd: 1(-0.7,0) 2(0.7,0)
CAP-SMD_BD6.3-L6.6-W6.6-LS7.6-RD
  rect 3.5x1.2 smd: 1(-2.67,0) 2(2.67,0)
CONN-TH_2P-P2.50_HX25003-2A
  rect 1.8x1.8 hole 1.1: 1(-1.25,0)
  round 1.8 hole 1.1: 2(1.25,0)
CONN-TH_6P-P2.00_HDGC_HDGC2001WR-6P
  rect 1.524x1.524 hole 0.914: 1(-5,0)
  round 1.524 hole 0.914: 2(-3,0) 3(-1,0) 4(1,0) 5(3,0) 6(5,0)
hdr-th_1p-p2.54-v-m
  rect 1.7x1.7 hole 1.1: 1(0,0)
HDR-TH_1P-P2.54-V-M
  rect 1.7x1.7 hole 1.1: 1(0,0)
HDR-TH_6P-P2.54-V-F
  rect 1.8x1.6 hole 1.02: 1(-6.35,0)
  round 1.6 hole 1.02: 2(-3.81,0) 3(-1.27,0) 4(1.27,0) 5(3.81,0) 6(6.35,0)
HDR-TH_8P-P2.54-V-F-1
  rect 1.8x1.8 hole 1.2: 1(-8.89,0)
  round 1.8 hole 1.2: 2(-6.35,0) 3(-3.81,0) 4(-1.27,0) 5(1.27,0) 6(3.81,0) 7(6.35,0) 8(8.89,0)
HDR-TH_20P-P2.54-V-F
  rect 1.8x1.8 hole 1.2: 1(-24.13,0)
  round 1.8 hole 1.2: 2(-21.59,0) 3(-19.05,0) 4(-16.51,0) 5(-13.97,0) 6(-11.43,0) 7(-8.89,0) 8(-6.35,0) 9(-3.81,0) 10(-1.27,0) 11(1.27,0) 12(3.81,0) 13(6.35,0) 14(8.89,0) 15(11.43,0) 16(13.97,0) 17(16.51,0) 18(19.05,0) 19(21.59,0) 20(24.13,0)
OLED-TH_L27.8-W27.2-P2.54_C9900033791
  round 1.8 hole 1.05: 1(-3.81,0) 2(-1.27,0) 3(1.27,0) 4(3.81,0)
Pad_e40
  round 2.286 hole 2: 5(0,0)
Pad_e45
  round 2 hole 2.286: 5(0,0)
Pad_e47
  round 2.286 hole 2: 5(0,0)
Pad_e48
  round 2.286 hole 2: 5(0,0)
Pad_e71
  round 3.302 hole 3: 5(0,0)
Pad_e103
  round 3.302 hole 3: 5(0,0)
Pad_e1710
  round 3.81 hole 3: 0(0,0)
Pad_e1712
  round 3.81 hole 3: 0(0,0)
Pad_e1713
  round 3.81 hole 3: 0(0,0)
Pad_e1738
  round 3.81 hole 3: 0(0,0)
SMA_L4.3-W2.6-LS5.2-RD
  rect 2x2 smd: 1(-2.2,0) 2(2.2,0)
SOT-89_L4.5-W2.5-P1.50-LS4.2-BR
  rect 1.575x0.672 smd: 1(1.356,-1.5) 3(1.356,1.5)
  custom 5.377x1.9 smd: 2(-1.356,0.009)
SW-TH_SS-12D10L5
  round 2.5 hole 1.8: 1(-4.7,0) 2(0,0) 3(4.7,0)

## Nets
As in the schematic.

Pads without a net: NOREF 5; NOREF#2 0; NOREF#3 5; NOREF#4 0; NOREF#5 0; NOREF#6 0; NOREF#7 5; NOREF#8 5; NOREF#9 5; NOREF#10 5; 电源开关 3; 蓝牙模块 1 6

## Via types
v1: diameter 0.61, hole 0.305, Top Layer to Bottom Layer, 26 vias

## Routing (per net, layer and track width the routed paths; a pad name or vN(x,y) marks a point on that pad's centre or on a via; arc(x,y) is an arc through that point)
3.3V: length 183.6
  Top Layer w0.305: 29.85,41.84 C3.2 ; 29.85,41.84 29.85,41.38 ; 29.85,41.84 29.62,41.61 ; 29.62,41.61 29.85,41.38 ; 29.62,41.61 HT7833.3 ; 29.85,41.38 33.5,37.73 WT1-IMU串口.5 48.67,32.62 U3.4
  Top Layer w0.381: HT7833.3 27.94,41.52 27.94,40.15 27.3,39.52 17.91,39.52 v1(13.46,35.07) 10.46,32.07 左电机.5
  Bottom Layer w0.381: 蓝牙模块.5 5.46,57.43 8.25,54.63 8.25,40.28 v1(13.46,35.07) ; 右电机.5 92.25,38.07 90.68,39.65 90.68,63.27 86.23,67.71 69.09,67.71 63.88,62.51 63.88,58.06 WT1-IMU串口.5
5V: length 110
  Top Layer w0.381: 26.82,56.41 41.91,56.41 48.01,62.51 OLED.2 ; 26.82,56.41 26.35,55.94 ; 26.82,56.41 26.16,56.41 ; 电机驱动.7 43.65,6.22 D1.2 41.53,14.88 v1(40.39,16.02) ; 26.35,55.94 v1(26.35,54.12) ; 26.35,55.94 26.35,56.22 26.16,56.41 ; HT7833.2 28.22,44.32 v1(29.08,43.46) ; HT7833.2 v1(26.35,47.52) ; HT7833.2 23.49,44.32 C2.2 ; 26.16,56.41 18.29,64.28 OUT+.1
  Bottom Layer w0.381: 26.42,47.58 v1(26.35,47.52) v1(26.35,54.12) ; v1(40.39,16.02) 33.78,22.63 33.78,38.76 v1(29.08,43.46)
5VIN: length 25.7
  Top Layer w0.381: D1.1 70.55,14.88 STM32F103C8T6核心板.3
6-12V: length 11
  Top Layer w0.635: 电池电源.1 17,11.96 21.08,11.96 23.22,9.82 电源开关.1
AIN1: length 66.6
  Top Layer w0.305: U3.3 46.52,21.57 v1(49.15,18.95) ; v1(56.13,13.36) 60.33,9.17 81.66,9.17 84.58,12.09 84.58,28.78 Stlink.12
  Bottom Layer w0.305: v1(49.15,18.95) 50.55,18.95 v1(56.13,13.36)
AIN2: length 71.8
  Top Layer w0.305: U3.2 43.59,19.3 44.7,18.18 v1(52.32,18.18) ; 88.18,34.92 83.69,30.43 83.69,12.21 81.41,9.93 61.98,9.93 v1(59.05,12.85)
  Bottom Layer w0.305: v1(52.32,18.18) 53.72,18.18 v1(59.05,12.85)
AO1: length 67.3
  Top Layer w0.305: v1(18.54,38.63) 18.67,38.5 29.59,38.5 36.32,31.77 36.32,14.88 v1(40.77,10.44)
  Top Layer w0.381: 左电机.1 10.62,40.07 v1(11.56,39.14)
  Bottom Layer w0.305: 电机驱动.5 48.67,8.51 46.74,10.44 v1(40.77,10.44)
  Bottom Layer w0.381: v1(11.56,39.14) 12.06,38.63 v1(18.54,38.63)
AO2: length 62.8
  Top Layer w0.305: 电机驱动.4 48.46,8.91 v1(45.47,8.91) ; 左电机.6 6.78,30.12 10.54,30.12 12.06,31.65 29.97,31.65 35.05,26.57 35.05,14.37 v1(40.51,8.91)
  Bottom Layer w0.305: v1(45.47,8.91) v1(40.51,8.91)
BIN1: length 54.1
  Top Layer w0.305: U3.5 51.21,22.4 53.85,25.04 64.77,25.04 69.34,29.61 69.34,48.79 70.36,49.81 70.36,56.16 71.37,57.17 71.37,58.88 STM32F103C8T6核心板.20
BIN2: length 56.6
  Top Layer w0.305: U3.6 53.75,19.43 55.37,17.8 63.88,17.8 69.98,23.9 69.98,48.54 70.99,49.55 70.99,55.96 72.81,57.78
BO1: length 60.8
  Top Layer w0.305: 电机驱动.2 59.12,3.32 86.36,3.32 92.71,9.67 92.71,29.57 右电机.1
BO2: length 80.2
  Top Layer w0.305: 右电机.6 95.08,40.07 97.28,37.87 97.28,11.83 87.63,2.18 57.73,2.18 电机驱动.3
IN+: length 38.3
  Top Layer w0.635: 电机驱动.8 31.05,6.16 电源开关.2 27.92,15.25 ; 27.92,15.25 27.92,15.5 C1.1 ; 27.92,15.25 19.38,23.79 IN+.1
PA0: length 14.5
  Top Layer w0.305: 右电机.3 92.34,34.07 90.93,32.66 90.93,24.97 Stlink.16
PA1: length 14.5
  Top Layer w0.305: 88.18,24.76 90.04,26.62 90.04,34.82 91.3,36.07 右电机.4
PA2: length 93.4
  Top Layer w0.305: v1(41.66,11.33) 37.34,15.64 37.34,31.26 41.27,35.19 WT1-IMU串口.4 ; Stlink.14 86.23,25.35 86.23,11.96 82.17,7.9 59.69,7.9 56.26,11.33 v1(46.61,11.33)
  Bottom Layer w0.305: v1(41.66,11.33) v1(46.61,11.33)
PA3: length 90.6
  Top Layer w0.305: v1(45.47,12.34) 56.13,12.34 59.94,8.53 81.79,8.53 85.34,12.09 85.34,27 88.18,29.84 ; WT1-IMU串口.3 41.27,32.65 38.23,29.61 38.23,16.28 v1(42.16,12.34)
  Bottom Layer w0.305: v1(42.16,12.34) v1(45.47,12.34)
PA8: length 63.1
  Top Layer w0.305: STM32F103C8T6核心板.16 70.74,48.09 70.74,23.77 64.14,17.17 42.67,17.17 41.05,18.79 U3.1
PA9: length 96.9
  Top Layer w0.305: 蓝牙模块.2 8.25,49.81 9.27,48.79 67.31,48.79 69.72,51.2 69.72,56.28 70.74,57.3 70.74,61.11 72.01,62.38 73.79,62.38 74.55,61.62 74.55,49.36 STM32F103C8T6核心板.15
PA10: length 101.1
  Top Layer w0.305: STM32F103C8T6核心板.14 74.04,46.31 74.04,47.9 75.18,49.04 75.18,61.74 74.04,62.89 71.5,62.89 70.23,61.62 70.23,57.55 69.09,56.41 69.09,51.71 67.06,49.68 9.65,49.68 8.64,50.7 5.59,50.7 蓝牙模块.3
PA11: length 78.4
  Top Layer w0.305: v1(66.67,25.17) 65.79,24.28 58.29,24.28 56.29,22.27 U3.7 ; v1(66.67,46.38) v1(66.67,29.11) ; STM32F103C8T6核心板.13 74.04,43.77 74.04,45.36 74.55,45.87 74.55,47.65 75.95,49.04 75.95,61.87 74.42,63.4 71.12,63.4 69.72,62 69.72,57.93 68.45,56.66 68.45,52.85 66.67,51.08 v1(66.67,50.57)
  Bottom Layer w0.305: v1(66.67,50.57) v1(66.67,46.38) ; v1(66.67,29.11) v1(66.67,25.17)
PB6: length 128.5
  Top Layer w0.305: v1(14.6,46.25) 14.6,40.28 10.4,36.07 左电机.3 ; STM32F103C8T6核心板.7 76.58,31.07 76.58,62.13 74.8,63.9 70.99,63.9 69.21,62.13 69.21,58.57 67.82,57.17 67.82,53.24 66.55,51.97 v1(16.76,51.97)
  Bottom Layer w0.305: v1(16.76,51.97) 14.6,49.81 v1(14.6,46.25)
PB7: length 132
  Top Layer w0.305: v1(22.22,53.11) 66.8,53.11 67.18,53.49 67.18,57.81 68.58,59.2 68.58,62.38 70.74,64.54 75.18,64.54 77.22,62.51 77.22,29.16 72.81,24.76 ; 左电机.4 6.75,34.06 10.16,34.06 18.8,42.69 v1(18.8,46.25)
  Bottom Layer w0.305: v1(22.22,53.11) 18.8,49.68 v1(18.8,46.25)
PB8: length 76.4
  Top Layer w0.305: OLED.3 50.55,64.41 52.7,62.25 67.31,62.25 70.23,65.17 75.57,65.17 77.98,62.76 77.98,27.38 STM32F103C8T6核心板.5
PB9: length 77.1
  Top Layer w0.305: OLED.4 53.09,65.05 55.24,62.89 67.06,62.89 70.06,65.89 75.61,65.89 78.61,62.89 78.61,25.48 STM32F103C8T6核心板.4

## Copper pours and planes (outline as drawn; the poured copper is in the pictures)
GND on Top Layer: -18.03,87.5 118.74,87.5 118.74,-15.88 -18.03,-15.88
GND on Bottom Layer: -17.27,86.87 118.11,86.87 118.11,-14.99 -17.27,-14.99

## Text on the board
Top Silkscreen Layer: VCC | GND | TX | RX | 降压模块
